# EAGLE schematic MaTouch ESP32-P4 TFT with 4G LTE  Touch 10.1“ MIPI V1.1 (EAGLE 6.1)
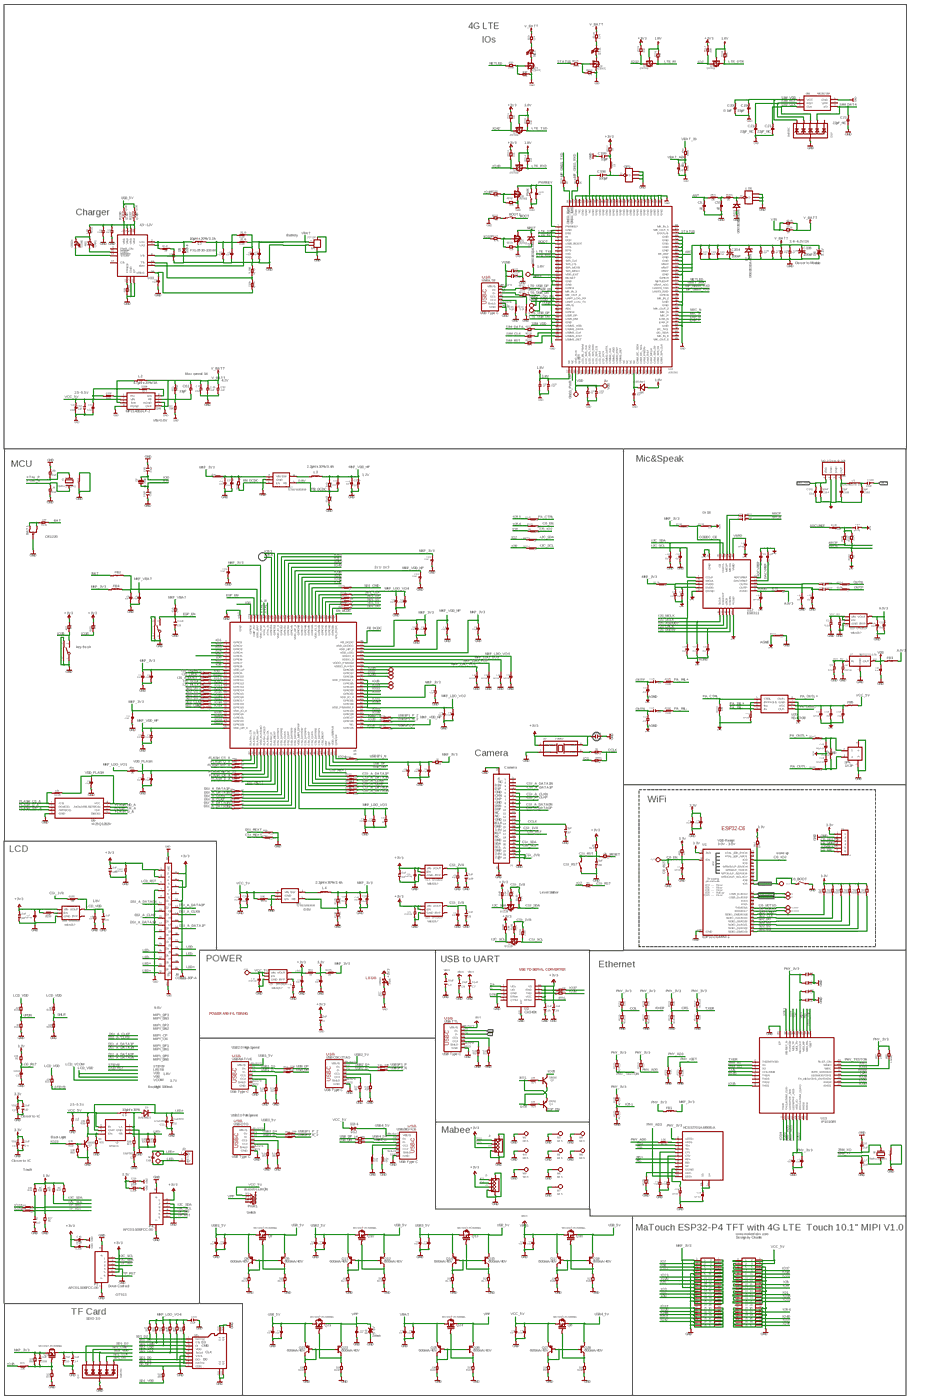
[diagram p0: schematic, sheet 1, overview]
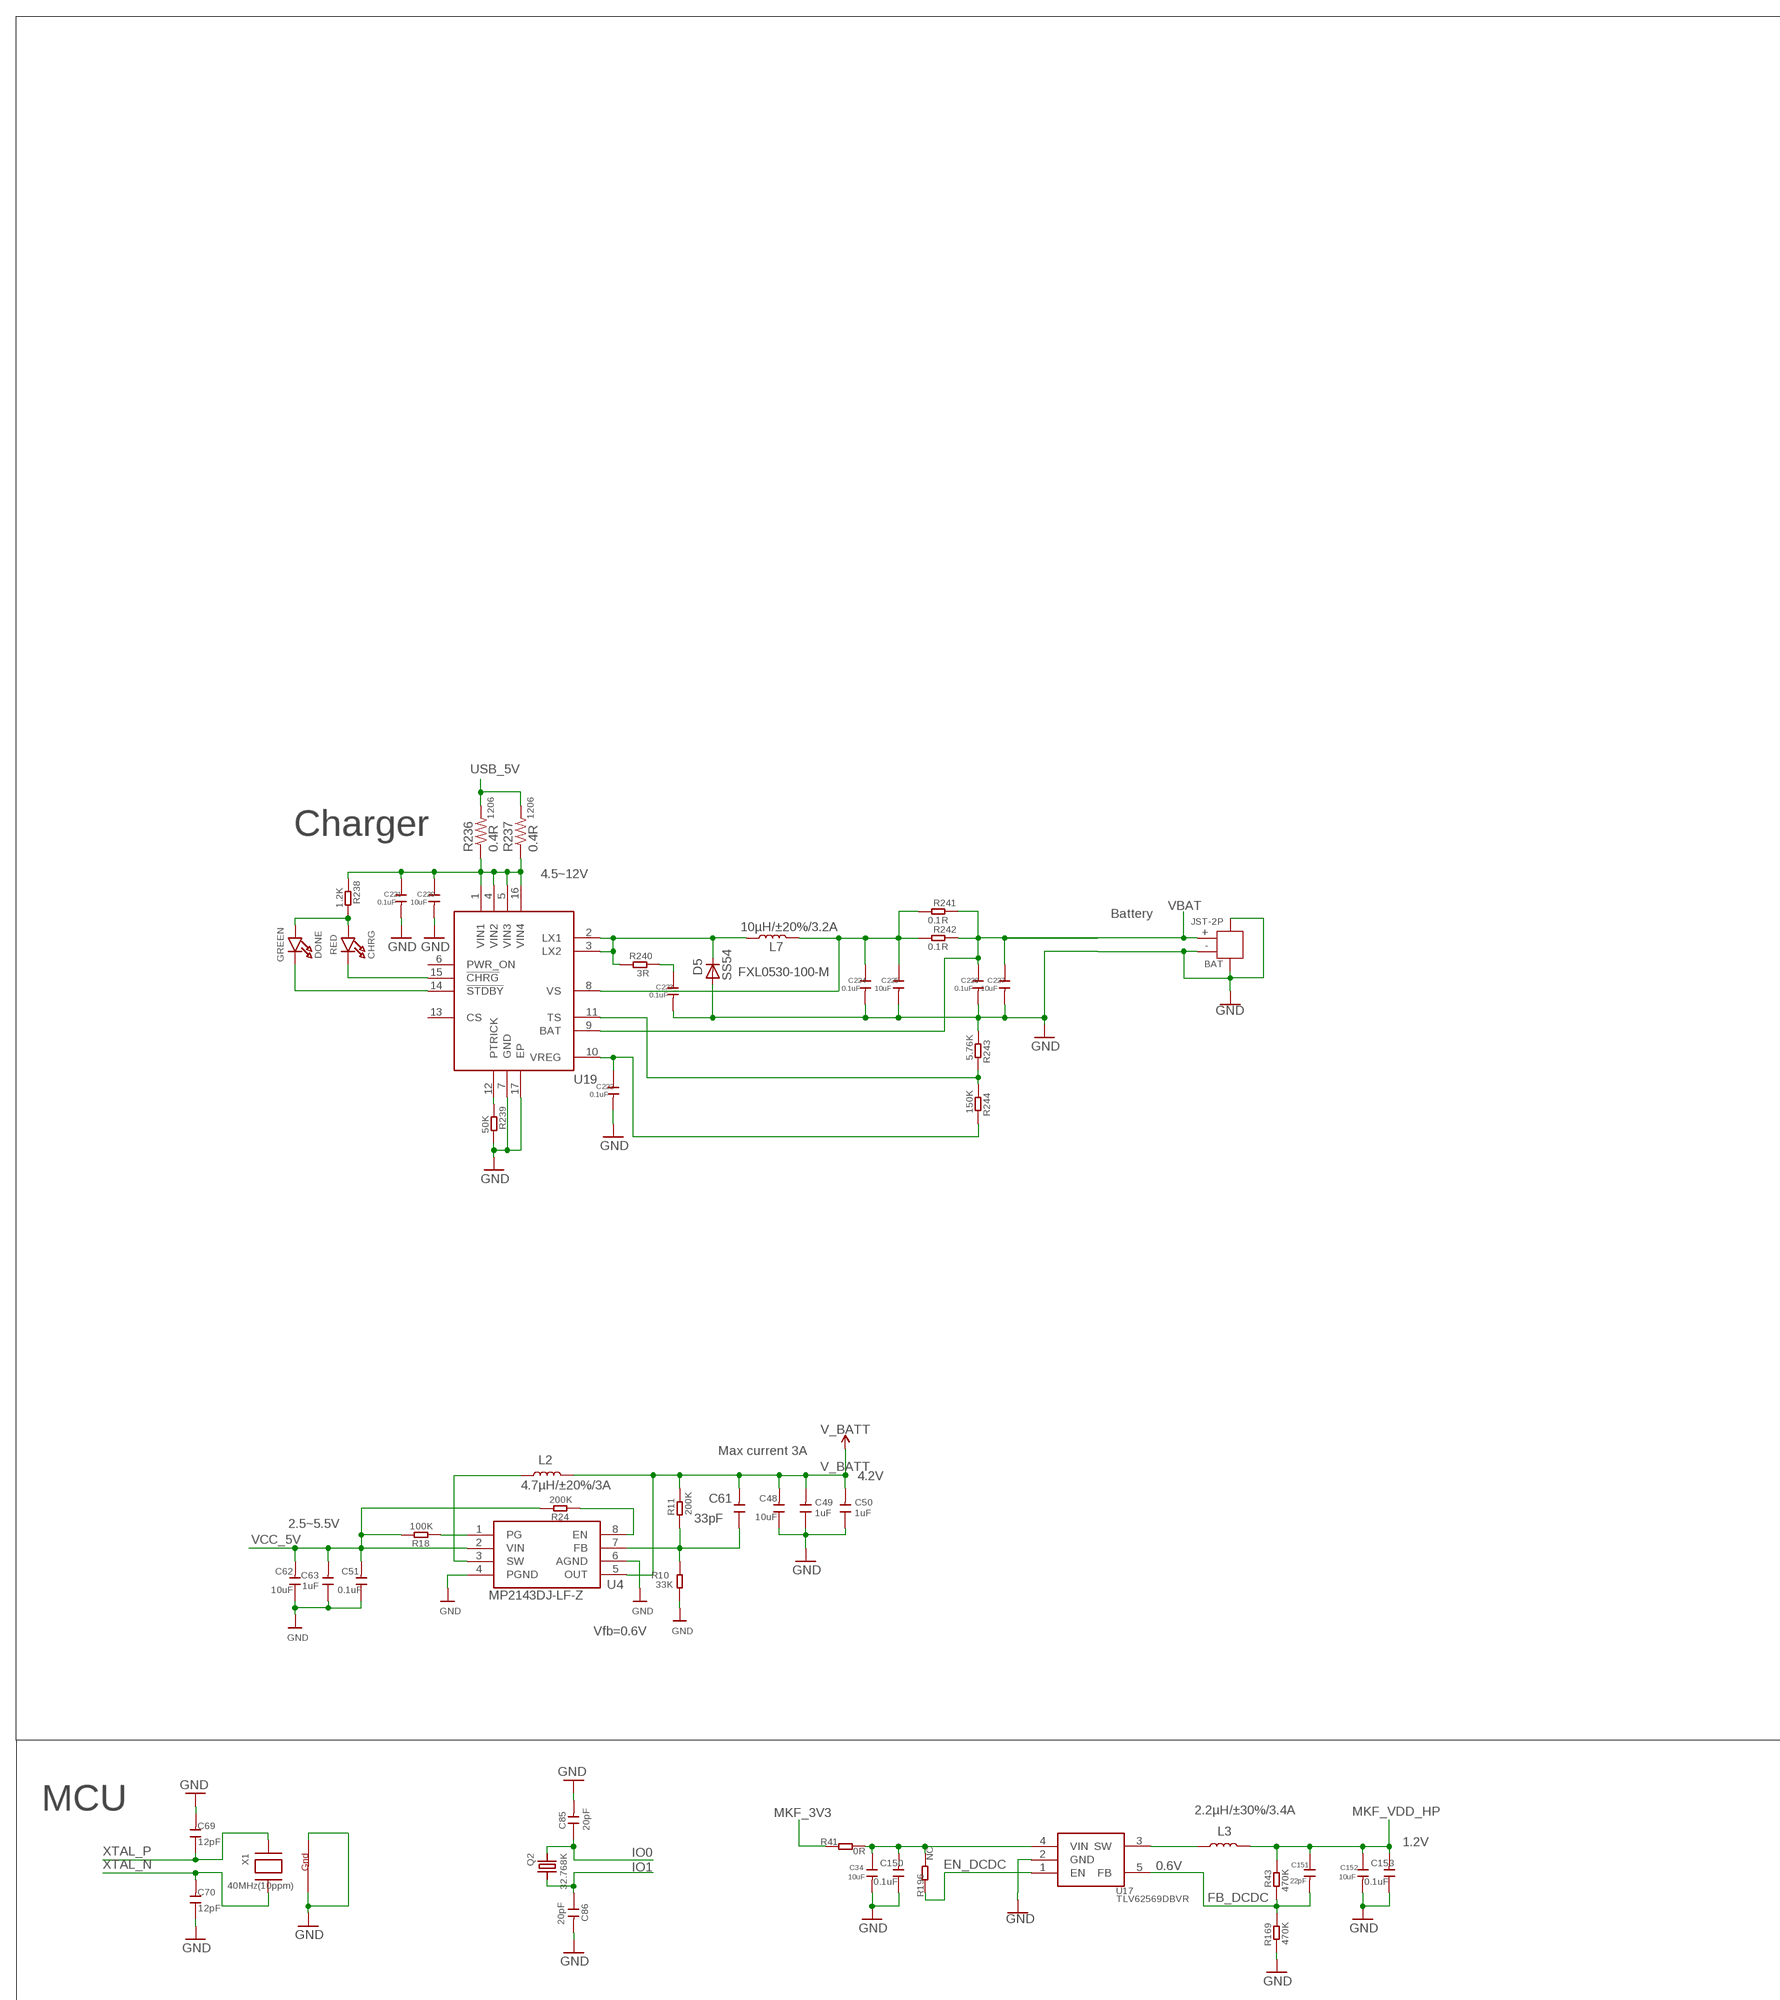
[diagram p1: schematic, sheet 1, part 1 of 6]
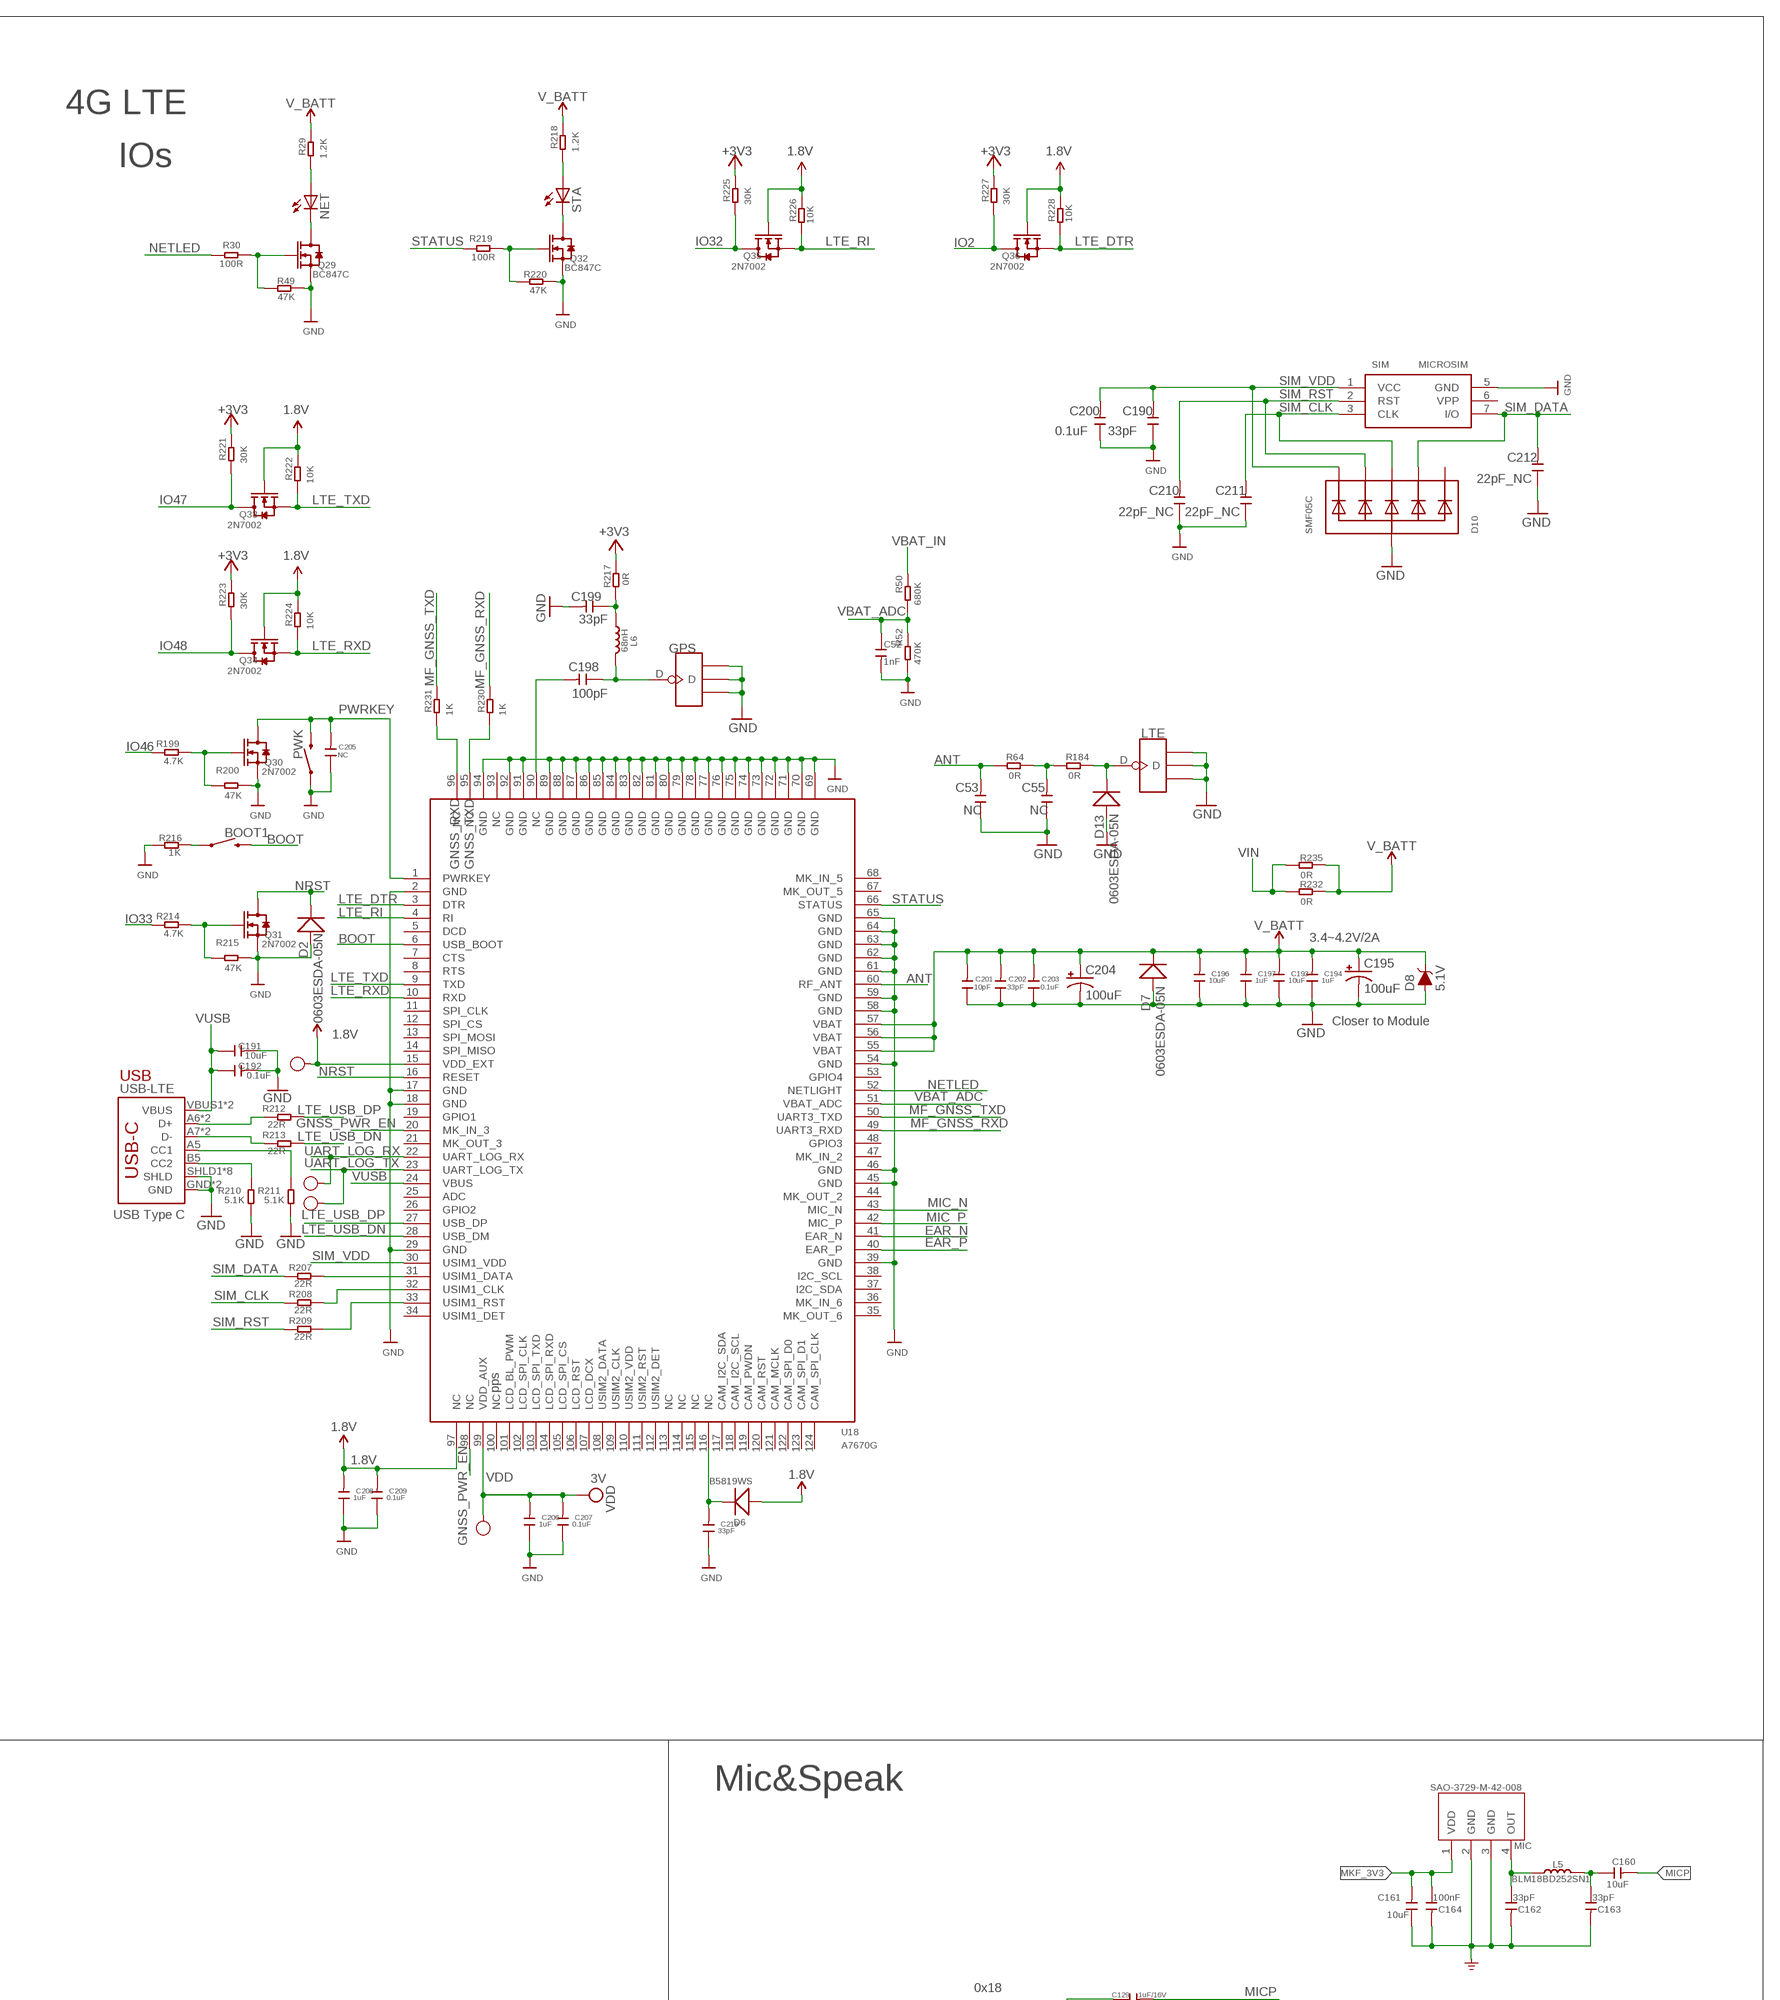
[diagram p2: schematic, sheet 1, part 2 of 6]
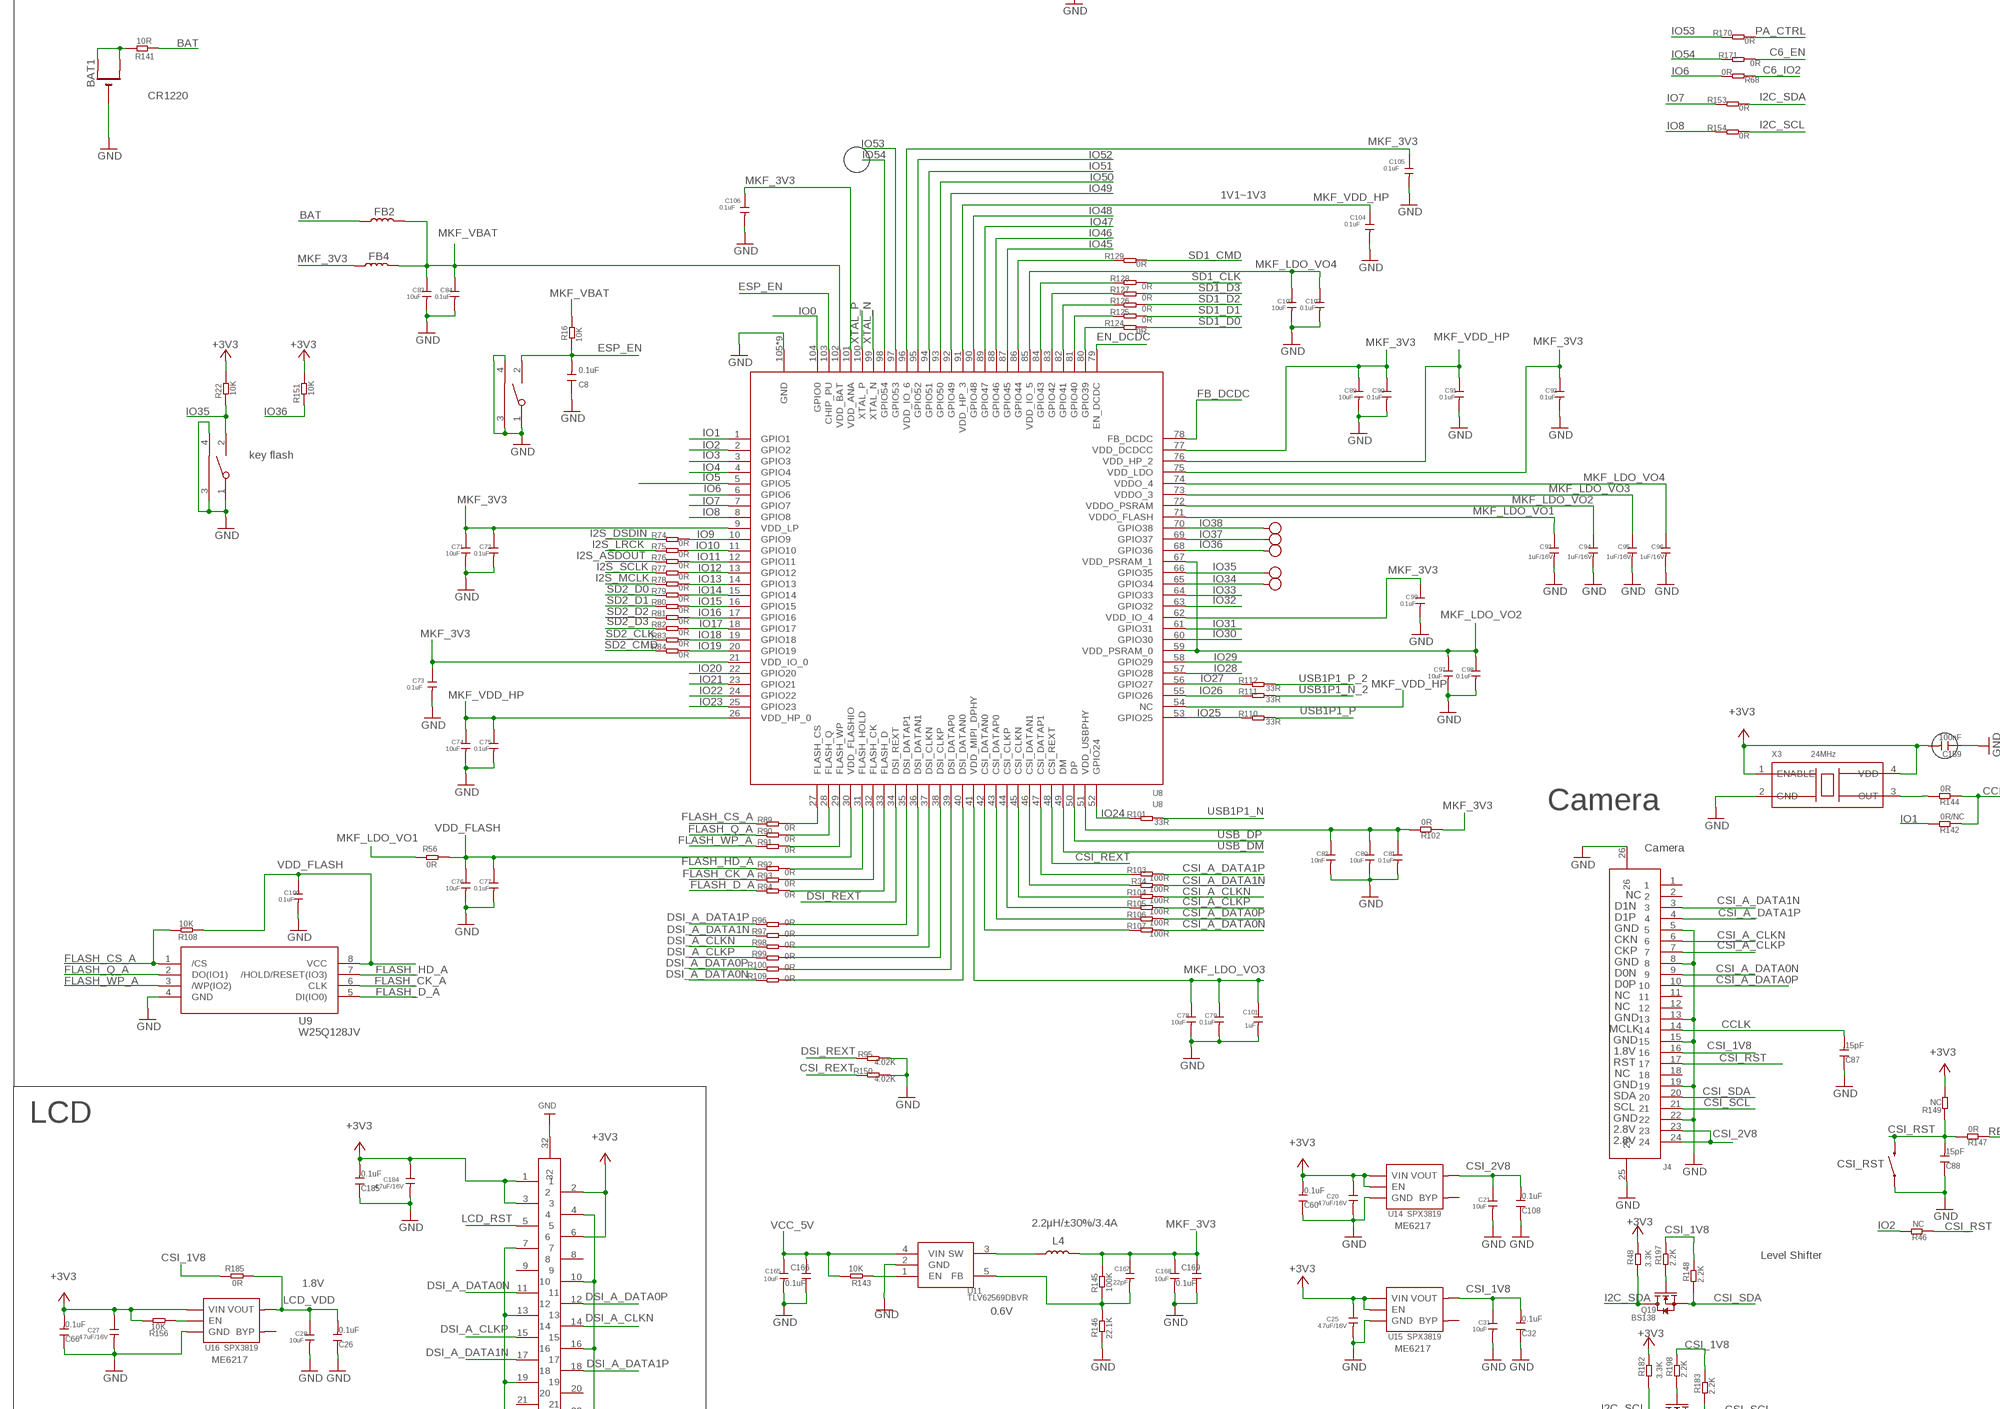
[diagram p3: schematic, sheet 1, part 3 of 6]
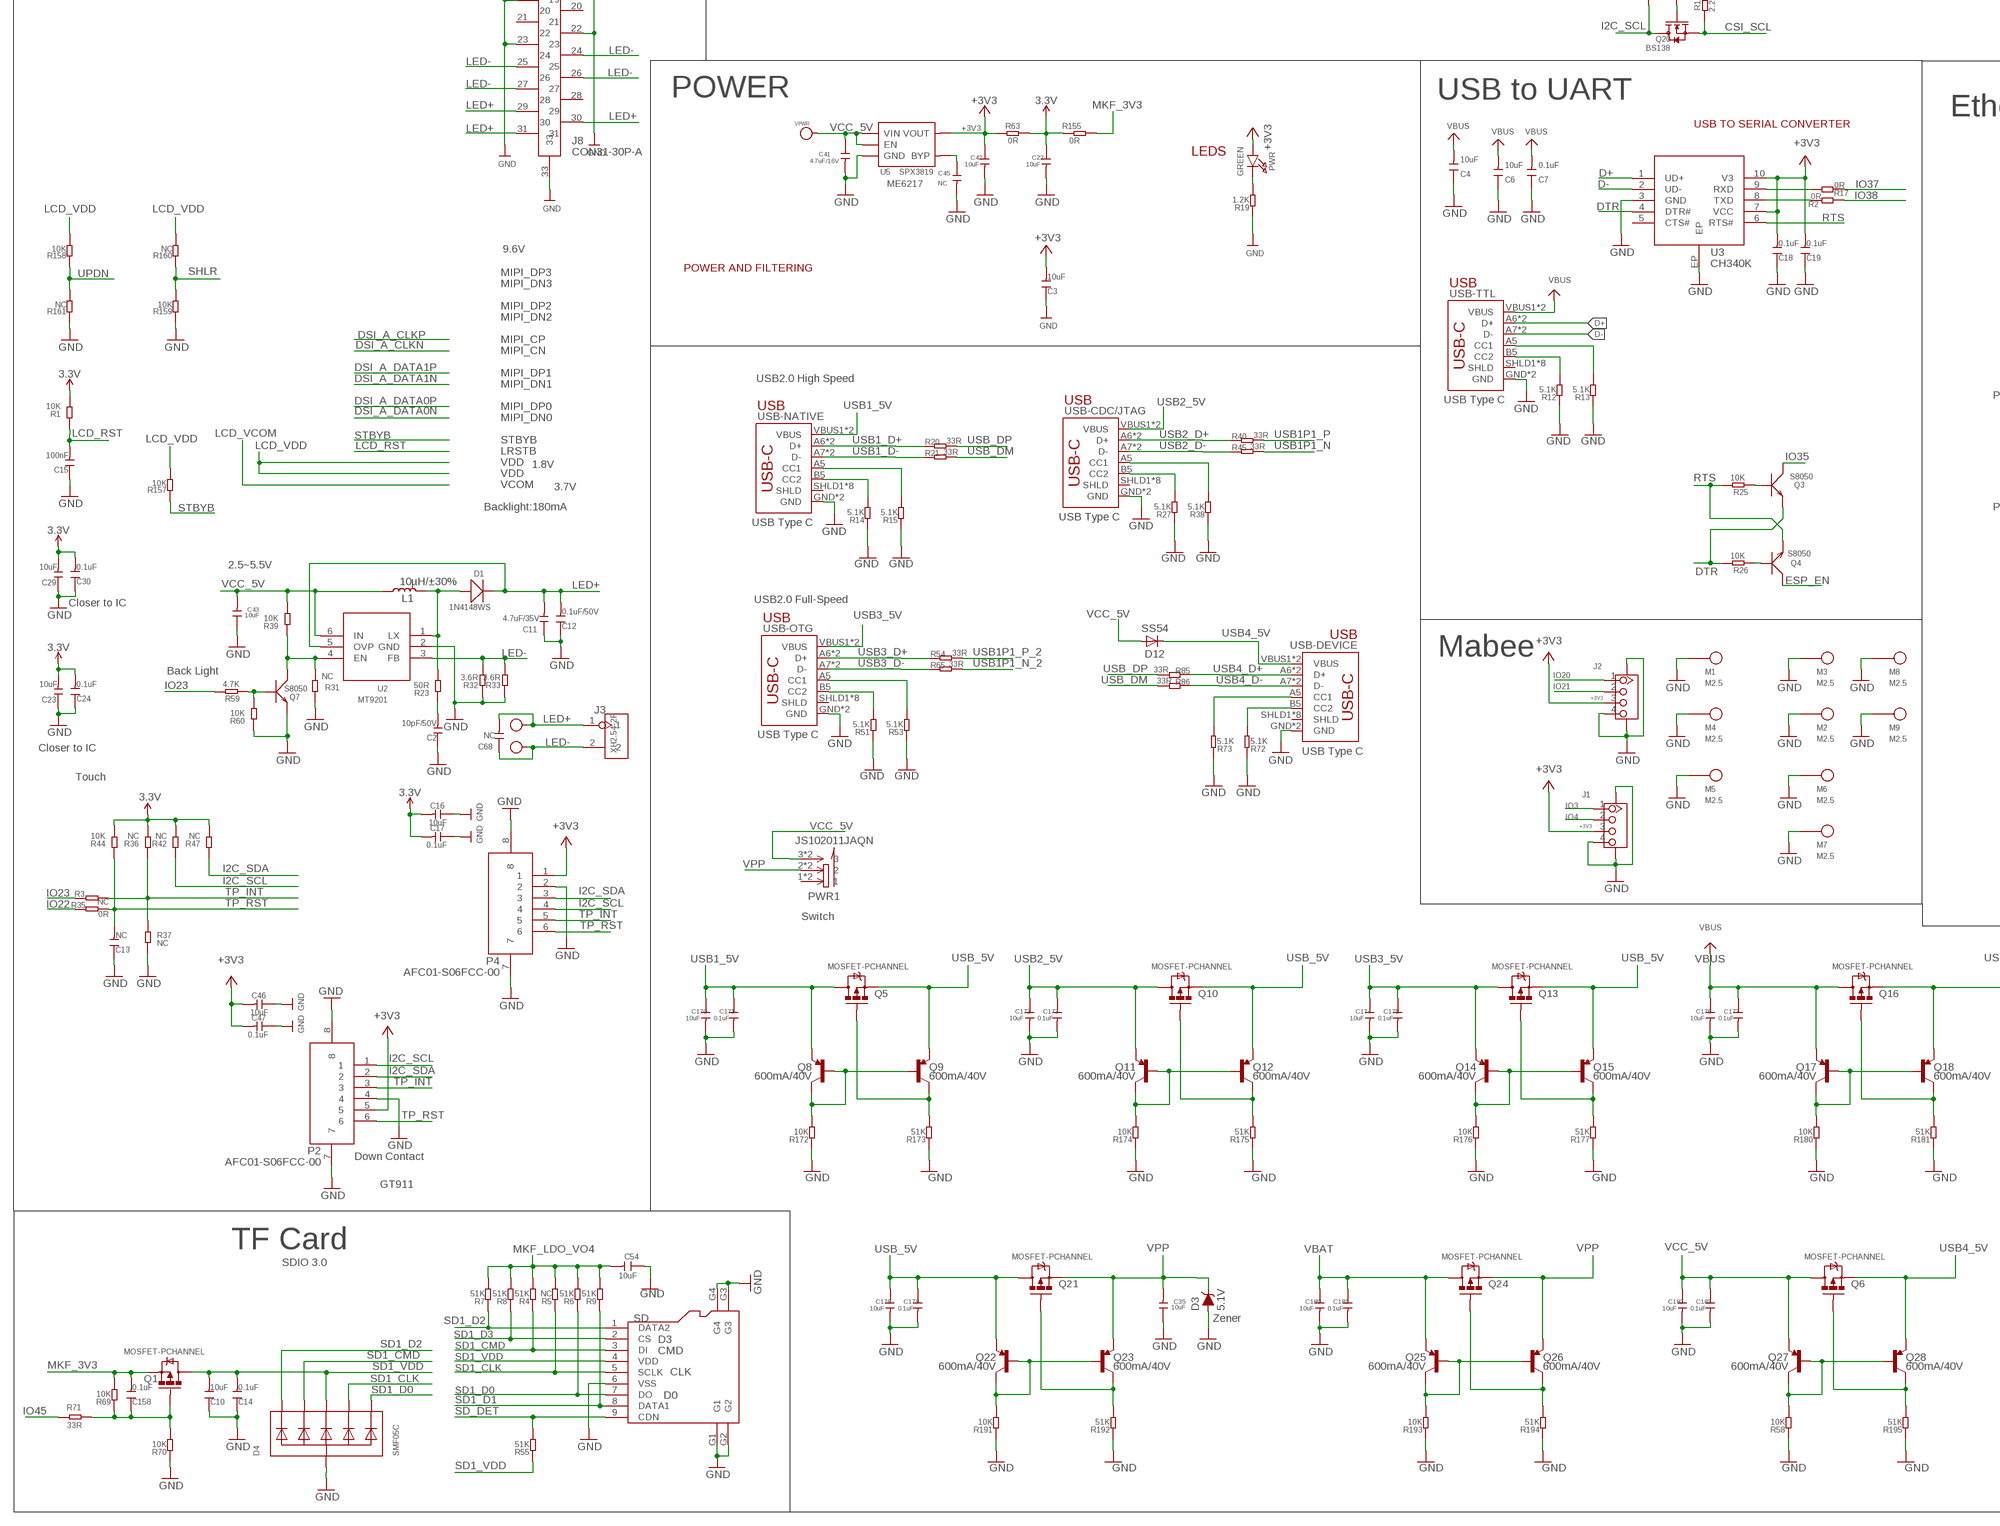
[diagram p4: schematic, sheet 1, part 4 of 6]
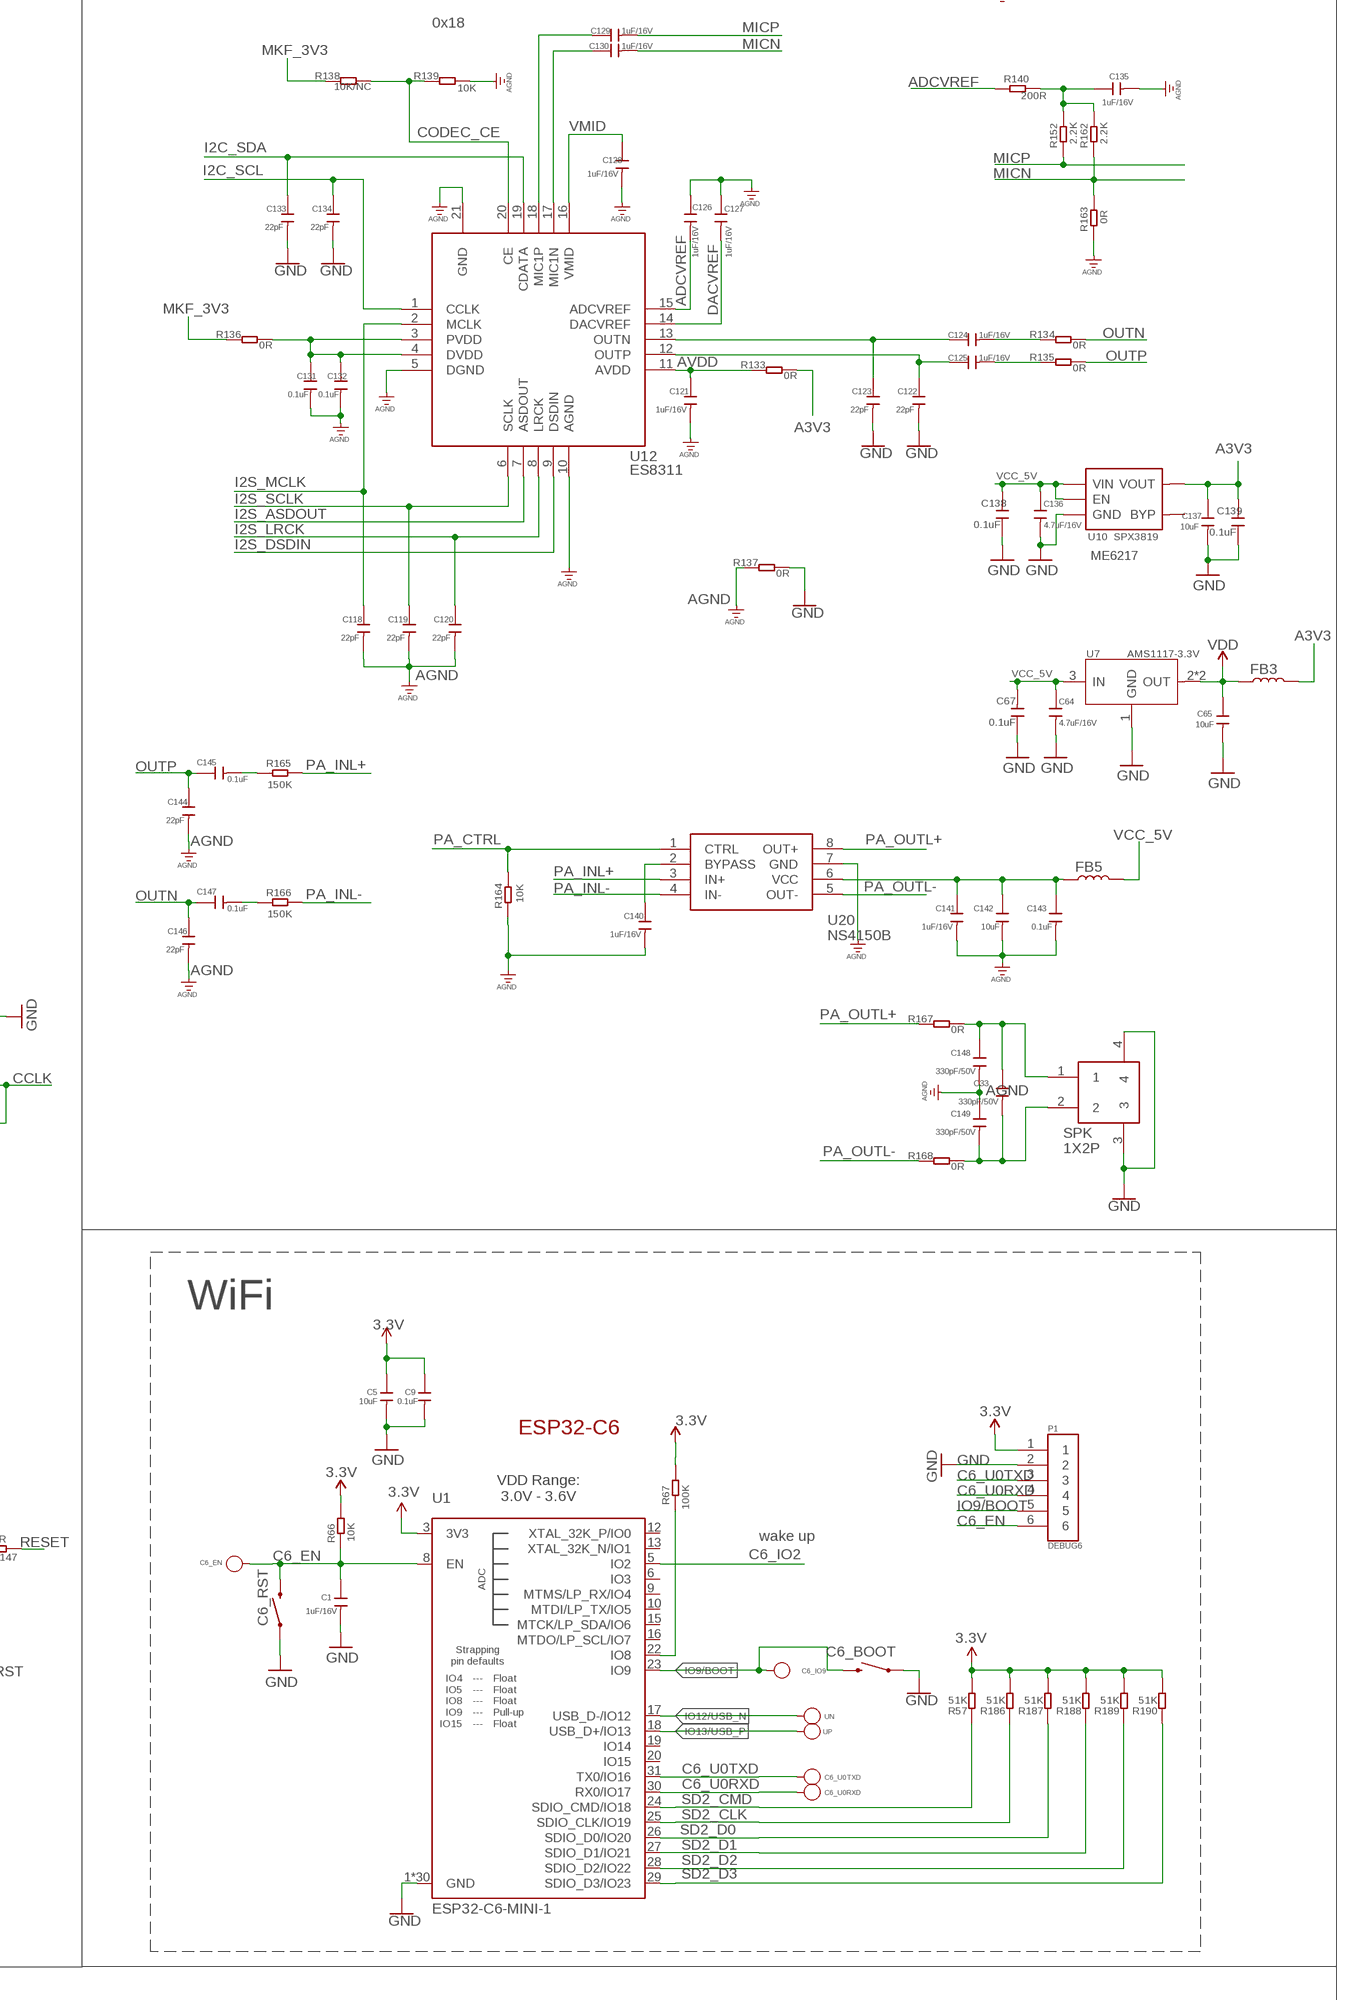
[diagram p5: schematic, sheet 1, part 5 of 6]
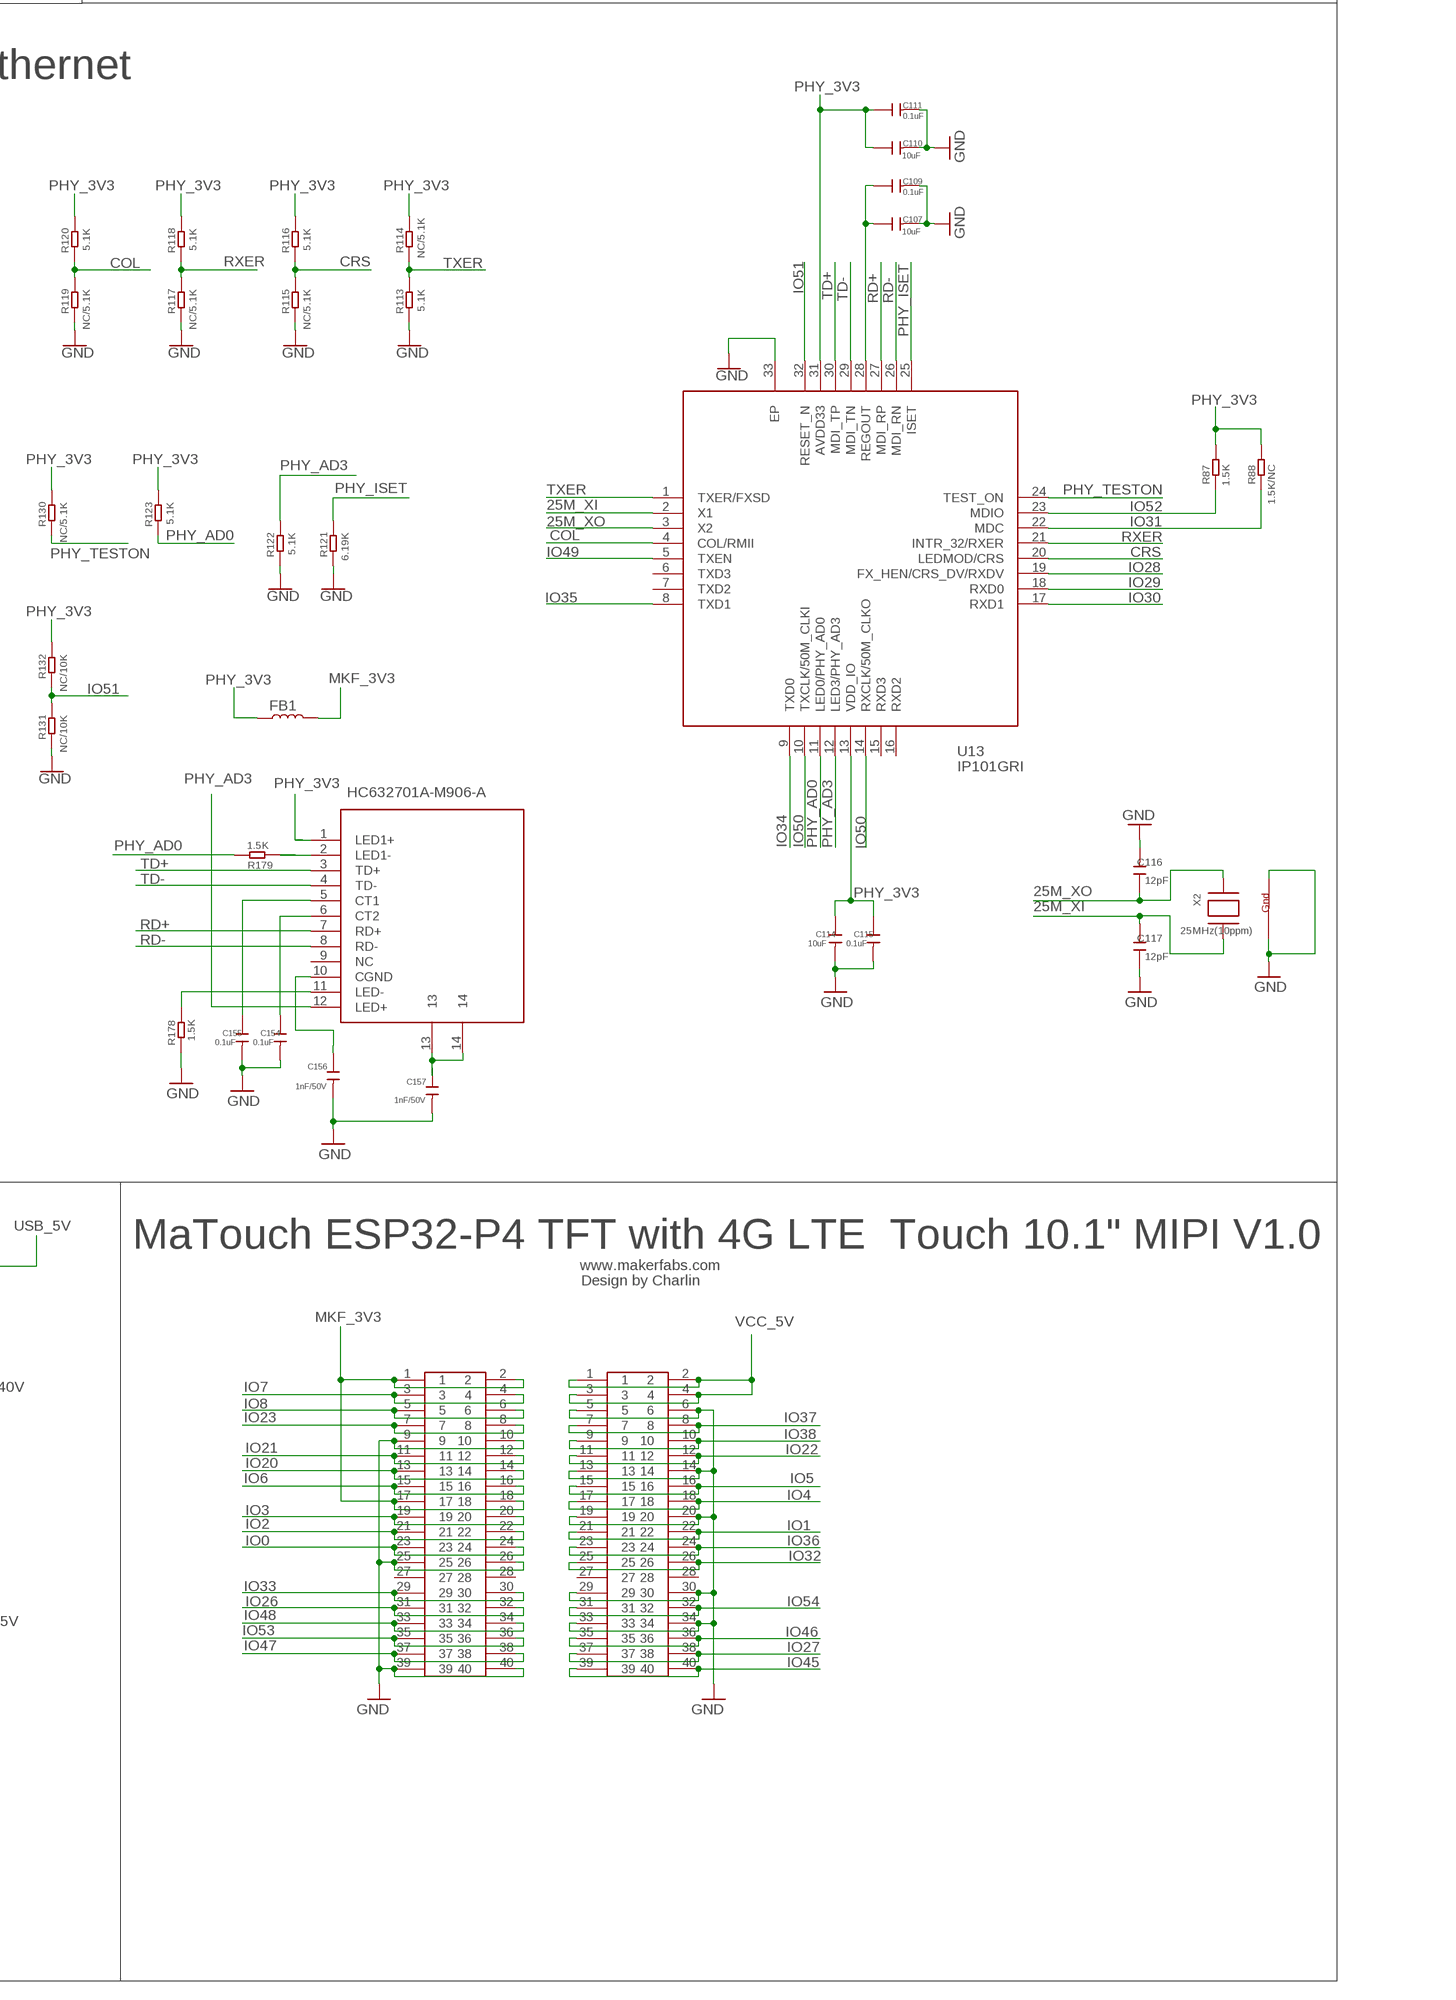
[diagram p6: schematic, sheet 1, part 6 of 6]

## Parts
1V8  TEST-POINT'4545'  [TP-D45MIL]
3V  TEST-POINT'4545'  [TP-D45MIL]
BAT  JST-2P  JST-2P-SMD'2.0'  [HW2-SMD-2.0-90D]
BAT1  CR1220SMT  [CR1220-SMD]
BOOT  TS24CA  [2*4*3.5MM]
BOOT1  MOMENTARY-SWITCH-SPST-SMD-6.0X3.5MM  [TACTILE_SWITCH_SMD_6.0X3.5MM]
C1  1uF/16V  C-0603  [0603]
C2  10pF/50V  DISCRETE_C-0603  [DISCRETE_C0603]
C3  10uF  DISCRETE_C-0603  [DISCRETE_C0603]
C4  10uF  DISCRETE_C-0603  [DISCRETE_C0603]
C5  10uF  C-0603  [0603]
C6  10uF  DISCRETE_C-0603  [DISCRETE_C0603]
C6_BOOT  MOMENTARY-SWITCH-SPST-SMD-4.6X2.8MM  [TACTILE_SWITCH_SMD_4.6X2.8MM]
C6_EN  PAD-TEST-POINT-CIRCLE'4545'  [TP_4545]
C6_IO9  PAD-TEST-POINT-CIRCLE'4545'  [TP_4545]
C6_RST  MOMENTARY-SWITCH-SPST-SMD-4.6X2.8MM  [TACTILE_SWITCH_SMD_4.6X2.8MM]
C6_U0RXD  PAD-TEST-POINT-CIRCLE'4545'  [TP_4545]
C6_U0TXD  PAD-TEST-POINT-CIRCLE'4545'  [TP_4545]
C7  0.1uF  DISCRETE_C-0603  [DISCRETE_C0603]
C8  0.1uF  DISCRETE_C-0603  [DISCRETE_C0603]
C9  0.1uF  C-0603  [0603]
C10  10uF  DISCRETE_C-0603  [DISCRETE_C0603]
C11  4.7uF/35V  DISCRETE_C-1206  [DISCRETE_C1206]
C12  0.1uF/50V  DISCRETE_C-0603  [DISCRETE_C0603]
C13  NC  DISCRETE_C-0603  [DISCRETE_C0603]
C14  0.1uF  DISCRETE_C-0603  [DISCRETE_C0603]
C15  100nF  DISCRETE_C-0603  [DISCRETE_C0603]
C16  10uF  DISCRETE_C-0603  [DISCRETE_C0603]
C17  0.1uF  DISCRETE_C-0603  [DISCRETE_C0603]
C18  0.1uF  DISCRETE_C-0603  [DISCRETE_C0603]
C19  0.1uF  DISCRETE_C-0603  [DISCRETE_C0603]
C20  4.7uF/16V  C-0603  [0603]
C21  10uF  C-0603  [0603]
C22  10uF  C-0603  [0603]
C23  10uF  DISCRETE_C-0603  [DISCRETE_C0603]
C24  0.1uF  DISCRETE_C-0603  [DISCRETE_C0603]
C25  4.7uF/16V  C-0603  [0603]
C26  0.1uF  DISCRETE_C-0603  [DISCRETE_C0603]
C27  4.7uF/16V  C-0603  [0603]
C28  10uF  C-0603  [0603]
C29  10uF  DISCRETE_C-0603  [DISCRETE_C0603]
C30  0.1uF  DISCRETE_C-0603  [DISCRETE_C0603]
C31  10uF  C-0603  [0603]
C32  0.1uF  DISCRETE_C-0603  [DISCRETE_C0603]
C33  330pF/50V  C-0603  [0603]
C34  10uF  C-0603  [0603]
C35  10uF  C-0603  [0603]
C41  4.7uF/16V  C-0603  [0603]
C42  10uF  C-0603  [0603]
C43  10uF  C-0603  [0603]
C45  NC  C-0603  [0603]
C46  10uF  DISCRETE_C-0603  [DISCRETE_C0603]
C47  0.1uF  DISCRETE_C-0603  [DISCRETE_C0603]
C48  10uF  C-0603  [0603]
C49  1uF  C-0603  [0603]
C50  1uF  C-0603  [0603]
C51  0.1uF  C-0603  [0603]
C52  1nF  C-0603  [0603]
C53  NC  C-0603  [0603]
C54  10uF  DISCRETE_C-0603  [DISCRETE_C0603]
C55  NC  C-0603  [0603]
C60  0.1uF  DISCRETE_C-0603  [DISCRETE_C0603]
C61  33pF  C-0603  [0603]
C62  10uF  C-0603  [0603]
C63  1uF  C-0603  [0603]
C64  4.7uF/16V  C-0603  [0603]
C65  10uF  C-0603  [0603]
C66  0.1uF  DISCRETE_C-0603  [DISCRETE_C0603]
C67  0.1uF  C-0603  [0603]
C68  NC  DISCRETE_C-1206  [DISCRETE_C1206]
C69  12pF  DISCRETE_C-0402  [DISCRETE_C0402]
C70  12pF  DISCRETE_C-0402  [DISCRETE_C0402]
C71  10uF  C-0603  [0603]
C72  0.1uF  C-0603  [0603]
C73  0.1uF  C-0603  [0603]
C74  10uF  C-0603  [0603]
C75  0.1uF  C-0603  [0603]
C76  10uF  C-0603  [0603]
C77  0.1uF  C-0603  [0603]
C78  10uF  C-0603  [0603]
C79  0.1uF  C-0603  [0603]
C80  10uF  C-0603  [0603]
C81  0.1uF  C-0603  [0603]
C82  10nF  C-0603  [0603]
C83  10uF  C-0603  [0603]
C84  0.1uF  C-0603  [0603]
C85  20pF  DISCRETE_C-0603  [DISCRETE_C0603]
C86  20pF  DISCRETE_C-0603  [DISCRETE_C0603]
C87  15pF  DISCRETE_C-0603  [DISCRETE_C0603]
C88  15pF  DISCRETE_C-0603  [DISCRETE_C0603]
C89  10uF  C-0603  [0603]
C90  0.1uF  C-0603  [0603]
C91  0.1uF  C-0603  [0603]
C92  0.1uF  C-0603  [0603]
C93  1uF/16V  C-0603  [0603]
C94  1uF/16V  C-0603  [0603]
C95  1uF/16V  C-0603  [0603]
C96  1uF/16V  C-0603  [0603]
C97  10uF  C-0603  [0603]
C98  0.1uF  C-0603  [0603]
C99  0.1uF  C-0603  [0603]
C100  0.1uF  C-0603  [0603]
C101  1uF  C-0603  [0603]
C102  10uF  C-0603  [0603]
C103  0.1uF  C-0603  [0603]
C104  0.1uF  C-0603  [0603]
C105  0.1uF  C-0603  [0603]
C106  0.1uF  C-0603  [0603]
C107  10uF  C-0603  [0603]
C108  0.1uF  DISCRETE_C-0603  [DISCRETE_C0603]
C109  0.1uF  C-0603  [0603]
C110  10uF  C-0603  [0603]
C111  0.1uF  C-0603  [0603]
C114  10uF  C-0603  [0603]
C115  0.1uF  C-0603  [0603]
C116  12pF  DISCRETE_C-0402  [DISCRETE_C0402]
C117  12pF  DISCRETE_C-0402  [DISCRETE_C0402]
C118  22pF  C-0603  [0603]
C119  22pF  C-0603  [0603]
C120  22pF  C-0603  [0603]
C121  1uF/16V  C-0603  [0603]
C122  22pF  C-0603  [0603]
C123  22pF  C-0603  [0603]
C124  1uF/16V  C-0603  [0603]
C125  1uF/16V  C-0603  [0603]
C126  1uF/16V  C-0603  [0603]
C127  1uF/16V  C-0603  [0603]
C128  1uF/16V  C-0603  [0603]
C129  1uF/16V  C-0603  [0603]
C130  1uF/16V  C-0603  [0603]
C131  0.1uF  C-0603  [0603]
C132  0.1uF  C-0603  [0603]
C133  22pF  C-0603  [0603]
C134  22pF  C-0603  [0603]
C135  1uF/16V  C-0603  [0603]
C136  4.7uF/16V  C-0603  [0603]
C137  10uF  C-0603  [0603]
C138  0.1uF  C-0603  [0603]
C139  0.1uF  C-0603  [0603]
C140  1uF/16V  C-0603  [0603]
C141  1uF/16V  C-0603  [0603]
C142  10uF  C-0603  [0603]
C143  0.1uF  C-0603  [0603]
C144  22pF  C-0603  [0603]
C145  0.1uF  C-0603  [0603]
C146  22pF  C-0603  [0603]
C147  0.1uF  C-0603  [0603]
C148  330pF/50V  C-0603  [0603]
C149  330pF/50V  C-0603  [0603]
C150  0.1uF  C-0603  [0603]
C151  22pF  C-0603  [0603]
C152  10uF  C-0603  [0603]
C153  0.1uF  C-0603  [0603]
C154  0.1uF  C-0603  [0603]
C155  0.1uF  C-0603  [0603]
C156  1nF/50V  C-0603  [0603]
C157  1nF/50V  C-0603  [0603]
C158  0.1uF  DISCRETE_C-0603  [DISCRETE_C0603]
C159  100nF  CAP-0402  [C0402]
C160  10uF  CAP-0603  [C0603]
C161  10uF  CAP-0603  [C0603]
C162  33pF  CAP-0603  [C0603]
C163  33pF  CAP-0603  [C0603]
C164  100nF  CAP-0603  [C0603]
C165  10uF  C-0603  [0603]
C166  0.1uF  C-0603  [0603]
C167  22pF  C-0603  [0603]
C168  10uF  C-0603  [0603]
C169  0.1uF  C-0603  [0603]
C170  10uF  C-0603  [0603]
C171  0.1uF  C-0603  [0603]
C172  10uF  C-0603  [0603]
C173  0.1uF  C-0603  [0603]
C174  10uF  C-0603  [0603]
C175  0.1uF  C-0603  [0603]
C176  10uF  C-0603  [0603]
C177  0.1uF  C-0603  [0603]
C178  10uF  C-0603  [0603]
C179  0.1uF  C-0603  [0603]
C180  10uF  C-0603  [0603]
C181  0.1uF  C-0603  [0603]
C182  10uF  C-0603  [0603]
C183  0.1uF  C-0603  [0603]
C184  4.7uF/16V  C-0603  [0603]
C185  0.1uF  DISCRETE_C-0603  [DISCRETE_C0603]
C190  33pF  C-0603  [0603]
C191  10uF  C-0603  [0603]
C192  0.1uF  C-0603  [0603]
C193  10uF  C-0603  [0603]
C194  1uF  C-0603  [0603]
C195  100uF  68UF-POLAR-EIA3528-10V-10%(TANT)  [EIA3528]
C196  10uF  C-0603  [0603]
C197  1uF  C-0603  [0603]
C198  100pF  C-0603  [0603]
C199  33pF  C-0603  [0603]
C200  0.1uF  C-0603  [0603]
C201  10pF  C-0603  [0603]
C202  33pF  C-0603  [0603]
C203  0.1uF  C-0603  [0603]
C204  100uF  68UF-POLAR-EIA3528-10V-10%(TANT)  [EIA3528]
C205  NC  C-0603  [0603]
C206  1uF  C-0603  [0603]
C207  0.1uF  C-0603  [0603]
C208  1uF  C-0603  [0603]
C209  0.1uF  C-0603  [0603]
C210  22pF_NC  C-0603  [0603]
C211  22pF_NC  C-0603  [0603]
C212  22pF_NC  C-0603  [0603]
C219  33pF  C-0603  [0603]
C220  10uF  C-0603  [0603]
C221  0.1uF  C-0603  [0603]
C222  0.1uF  C-0603  [0603]
C223  0.1uF  C-0603  [0603]
C224  0.1uF  C-0603  [0603]
C225  10uF  C-0603  [0603]
C226  0.1uF  C-0603  [0603]
C227  10uF  C-0603  [0603]
CHRG  RED  LED0805_NOOUTLINE  [CHIPLED_0805_NOOUTLINE]
CSI_RST  MOMENTARY-SWITCH-SPST-SMD-4.6X2.8MM  [TACTILE_SWITCH_SMD_4.6X2.8MM]
D1  1N4148WS  D'0805'  [SOD323]
D2  0603ESDA-05N  DISCRETE_D0603  [DISCRETE_SOD523]
D3  5.1V  DIODE-ZENER-MMSZ5232BS  [SOD-323]
D4  SMF05C  TVSARRAY_5LANE  [SOT363]
D5  SS54  DIODE-DO-214AC  [DO-214AC]
D6  B5819WS  D'0805'  [SOD323]
D7  0603ESDA-05N  DISCRETE_D0603  [DISCRETE_SOD523]
D8  5.1V  DIODE-ZENER-MMSZ5232BS  [SOD-323]
D10  SMF05C  TVSARRAY_5LANE  [SOT363]
D12  SS54  DIODE-DO-214AC  [DO-214AC]
D13  0603ESDA-05N  DISCRETE_D0603  [DISCRETE_SOD523]
D+  TEST-POINT'4545'  [TP-D45MIL]
D-  TEST-POINT'4545'  [TP-D45MIL]
DONE  GREEN  LED0805_NOOUTLINE  [CHIPLED_0805_NOOUTLINE]
FB1  INDUCTORFB-30OHM  [0603]
FB2  INDUCTORFB-30OHM  [0603]
FB3  INDUCTORFB-30OHM  [0603]
FB4  INDUCTORFB-30OHM  [0603]
FB5  INDUCTORFB-30OHM  [0603]
GPS  ANTENNA-U-FL  [4P-U-FL]
IO34  TEST-POINT'4545'  [TP-D45MIL]
IO35  TEST-POINT'4545'  [TP-D45MIL]
IO36  TEST-POINT'4545'  [TP-D45MIL]
IO37  TEST-POINT'4545'  [TP-D45MIL]
IO38  TEST-POINT'4545'  [TP-D45MIL]
J1  GROVE-CONNECTOR-SMD'90D'  [HW4-SMD-2.0-90D]
J2  GROVE-CONNECTOR-SMD'90D'  [HW4-SMD-2.0-90D]
J3  XH2.54-2P  [XH2.54-2P]
J4  FPC-24P  [SMD26-50P-1760L450W]
J6  CON2X20-254P-A  [SMD2X20-254P-5080L750W920H]
J7  HR961160C  [HR961160C]
J8  CON31-30P-A  [SMD31-30P-1090L320W100H]
J10  CON2X20-254P-A  [SMD2X20-254P-5080L750W920H]
L1  10µH/±30%  INDUCTOR-CR54-3.3UH  [CR54]
L2  4.7µH/±20%/3A  INDUCTOR-SRN6045-33UH  [SRN6045]
L3  2.2µH/±30%/3.4A  INDUCTOR-CR54-3.3UH  [CR54]
L4  2.2µH/±30%/3.4A  INDUCTOR-CR54-3.3UH  [CR54]
L5  BLM18BD252SN1  INDUCTOR/FERRITE-BEAD'0603'  [L0603]
L6  68nH  L'0603'  [L0603]
L7  10µH/±20%/3.2A  INDUCTOR-CR54-47UH  [CR54]
LTE  ANTENNA-U-FL  [4P-U-FL]
M1  M2.5  [M2.5]
M2  M2.5  [M2.5]
M3  M2.5  [M2.5]
M4  M2.5  [M2.5]
M5  M2.5  [M2.5]
M6  M2.5  [M2.5]
M7  M2.5  [M2.5]
M8  M2.5  [M2.5]
M9  M2.5  [M2.5]
MIC  SAO-3729-M-42-008  MIC-MSM421A3729H8-C  [MIC4-SMD-3.76X2.95MM]
NET  NET  LEDCHIP-LED0805  [CHIP-LED0805]
P1  DEBUG6  [DEBUG*6]
P2  AFC01-S06FCC-00  [SMD8-50P-740L535W]
P4  AFC01-S06FCC-00  [SMD8-50P-740L535W]
PWK  MOMENTARY-SWITCH-SPST-SMD-6.0X3.5MM  [TACTILE_SWITCH_SMD_6.0X3.5MM]
PWR  GREEN  LED0805_NOOUTLINE  [CHIPLED_0805_NOOUTLINE]
PWR1  JS102011JAQN  [SMD-6-2.5MM]
Q1  MOSFET-PCHANNEL  [SOT23-3]
Q2  32.768K  CRYSTAL_3215  [XTAL3215]
Q3  S8050  TRANSISTOR-NPN-SOT23  [SOT23]
Q4  S8050  TRANSISTOR-NPN-SOT23  [SOT23]
Q5  MOSFET-PCHANNEL  [SOT23-3]
Q6  MOSFET-PCHANNEL  [SOT23-3]
Q7  S8050  TRANSISTOR-NPN-SOT23  [SOT23]
Q8  600mA/40V  TRANS_PNP-MMBT4403  [SOT23-3]
Q9  600mA/40V  TRANS_PNP-MMBT4403  [SOT23-3]
Q10  MOSFET-PCHANNEL  [SOT23-3]
Q11  600mA/40V  TRANS_PNP-MMBT4403  [SOT23-3]
Q12  600mA/40V  TRANS_PNP-MMBT4403  [SOT23-3]
Q13  MOSFET-PCHANNEL  [SOT23-3]
Q14  600mA/40V  TRANS_PNP-MMBT4403  [SOT23-3]
Q15  600mA/40V  TRANS_PNP-MMBT4403  [SOT23-3]
Q16  MOSFET-PCHANNEL  [SOT23-3]
Q17  600mA/40V  TRANS_PNP-MMBT4403  [SOT23-3]
Q18  600mA/40V  TRANS_PNP-MMBT4403  [SOT23-3]
Q19  BS138  MOSFET-N'SOT23'  [SOT23]
Q20  BS138  MOSFET-N'SOT23'  [SOT23]
Q21  MOSFET-PCHANNEL  [SOT23-3]
Q22  600mA/40V  TRANS_PNP-MMBT4403  [SOT23-3]
Q23  600mA/40V  TRANS_PNP-MMBT4403  [SOT23-3]
Q24  MOSFET-PCHANNEL  [SOT23-3]
Q25  600mA/40V  TRANS_PNP-MMBT4403  [SOT23-3]
Q26  600mA/40V  TRANS_PNP-MMBT4403  [SOT23-3]
Q27  600mA/40V  TRANS_PNP-MMBT4403  [SOT23-3]
Q28  600mA/40V  TRANS_PNP-MMBT4403  [SOT23-3]
Q29  BC847C  MOSFET-N'SOT23'  [SOT23]
Q30  2N7002  MOSFET-N'SOT23'  [SOT23]
Q31  2N7002  MOSFET-N'SOT23'  [SOT23]
Q32  BC847C  MOSFET-N'SOT23'  [SOT23]
Q33  2N7002  MOSFET-N'SOT23'  [SOT23]
Q34  2N7002  MOSFET-N'SOT23'  [SOT23]
Q35  2N7002  MOSFET-N'SOT23'  [SOT23]
Q36  2N7002  MOSFET-N'SOT23'  [SOT23]
R1  10K  DISCRETE_R-0603  [DISCRETE_R0603]
R2  0R  R-0603  [R0603]
R3  NC  R-0603  [R0603]
R4  51K  DISCRETE_R-0603  [DISCRETE_R0603]
R5  NC  DISCRETE_R-0603  [DISCRETE_R0603]
R6  51K  DISCRETE_R-0603  [DISCRETE_R0603]
R7  51K  DISCRETE_R-0603  [DISCRETE_R0603]
R8  51K  DISCRETE_R-0603  [DISCRETE_R0603]
R9  51K  DISCRETE_R-0603  [DISCRETE_R0603]
R10  33K  R-0603  [R0603]
R11  200K  R-0603  [R0603]
R12  5.1K  DISCRETE_R-0603  [DISCRETE_R0603]
R13  5.1K  DISCRETE_R-0603  [DISCRETE_R0603]
R14  5.1K  DISCRETE_R-0603  [DISCRETE_R0603]
R15  5.1K  DISCRETE_R-0603  [DISCRETE_R0603]
R16  10K  R-0603  [R0603]
R17  0R  R-0603  [R0603]
R18  100K  R-0603  [R0603]
R19  1.2K  DISCRETE_R-0603  [DISCRETE_R0603]
R20  33R  R-0603  [R0603]
R21  33R  R-0603  [R0603]
R22  10K  R-0603  [R0603]
R23  50R  DISCRETE_R-0603  [DISCRETE_R0603]
R24  200K  R-0603  [R0603]
R25  10K  R-0603  [R0603]
R26  10K  R-0603  [R0603]
R27  5.1K  DISCRETE_R-0603  [DISCRETE_R0603]
R29  1.2K  R-0603  [R0603]
R30  100R  R-0603  [R0603]
R31  NC  DISCRETE_R-0603  [DISCRETE_R0603]
R32  3.6R  DISCRETE_R-0603  [DISCRETE_R0603]
R33  3.6R  DISCRETE_R-0603  [DISCRETE_R0603]
R34  100R  R-0603  [R0603]
R35  0R  R-0603  [R0603]
R36  NC  DISCRETE_R-0603  [DISCRETE_R0603]
R37  NC  DISCRETE_R-0603  [DISCRETE_R0603]
R38  5.1K  DISCRETE_R-0603  [DISCRETE_R0603]
R39  10K  DISCRETE_R-0603  [DISCRETE_R0603]
R40  33R  R-0603  [R0603]
R41  0R  R-0603  [R0603]
R42  NC  DISCRETE_R-0603  [DISCRETE_R0603]
R43  470K  R-0603  [R0603]
R44  10K  DISCRETE_R-0603  [DISCRETE_R0603]
R45  33R  R-0603  [R0603]
R46  NC  R-0603  [R0603]
R47  NC  DISCRETE_R-0603  [DISCRETE_R0603]
R48  3.3K  R-0603  [R0603]
R49  47K  R-0603  [R0603]
R50  680K  R-0603  [R0603]
R51  5.1K  DISCRETE_R-0603  [DISCRETE_R0603]
R52  470K  R-0603  [R0603]
R53  5.1K  DISCRETE_R-0603  [DISCRETE_R0603]
R54  33R  R-0603  [R0603]
R55  51K  DISCRETE_R-0603  [DISCRETE_R0603]
R56  0R  R-0603  [R0603]
R57  51K  DISCRETE_R-0603  [DISCRETE_R0603]
R58  10K  DISCRETE_R-0603  [DISCRETE_R0603]
R59  4.7K  DISCRETE_R-0603  [DISCRETE_R0603]
R60  10K  DISCRETE_R-0603  [DISCRETE_R0603]
R63  0R  R-0603  [R0603]
R64  0R  R-0603  [R0603]
R65  33R  R-0603  [R0603]
R66  10K  R-0603  [R0603]
R67  100K  R-0603  [R0603]
R68  0R  R-0603  [R0603]
R69  10K  DISCRETE_R-0603  [DISCRETE_R0603]
R70  10K  DISCRETE_R-0603  [DISCRETE_R0603]
R71  33R  R-0603  [R0603]
R72  5.1K  DISCRETE_R-0603  [DISCRETE_R0603]
R73  5.1K  DISCRETE_R-0603  [DISCRETE_R0603]
R74  0R  R-0603  [R0603]
R75  0R  R-0603  [R0603]
R76  0R  R-0603  [R0603]
R77  0R  R-0603  [R0603]
R78  0R  R-0603  [R0603]
R79  0R  R-0603  [R0603]
R80  0R  R-0603  [R0603]
R81  0R  R-0603  [R0603]
R82  0R  R-0603  [R0603]
R83  0R  R-0603  [R0603]
R84  0R  R-0603  [R0603]
R85  33R  R-0603  [R0603]
R86  33R  R-0603  [R0603]
R87  1.5K  R-0603  [R0603]
R88  1.5K/NC  R-0603  [R0603]
R89  0R  R-0603  [R0603]
R90  0R  R-0603  [R0603]
R91  0R  R-0603  [R0603]
R92  0R  R-0603  [R0603]
R93  0R  R-0603  [R0603]
R94  0R  R-0603  [R0603]
R95  4.02K  R-0603  [R0603]
R96  0R  R-0603  [R0603]
R97  0R  R-0603  [R0603]
R98  0R  R-0603  [R0603]
R99  0R  R-0603  [R0603]
R100  0R  R-0603  [R0603]
R101  33R  R-0603  [R0603]
R102  0R  R-0603  [R0603]
R103  100R  R-0603  [R0603]
R104  100R  R-0603  [R0603]
R105  100R  R-0603  [R0603]
R106  100R  R-0603  [R0603]
R107  100R  R-0603  [R0603]
R108  10K  DISCRETE_R-0603  [DISCRETE_R0603]
R109  0R  R-0603  [R0603]
R110  33R  R-0603  [R0603]
R111  33R  R-0603  [R0603]
R112  33R  R-0603  [R0603]
R113  5.1K  R-0603  [R0603]
R114  NC/5.1K  R-0603  [R0603]
R115  NC/5.1K  R-0603  [R0603]
R116  5.1K  R-0603  [R0603]
R117  NC/5.1K  R-0603  [R0603]
R118  5.1K  R-0603  [R0603]
R119  NC/5.1K  R-0603  [R0603]
R120  5.1K  R-0603  [R0603]
R121  6.19K  R-0603  [R0603]
R122  5.1K  R-0603  [R0603]
R123  5.1K  R-0603  [R0603]
R124  0R  R-0603  [R0603]
R125  0R  R-0603  [R0603]
R126  0R  R-0603  [R0603]
R127  0R  R-0603  [R0603]
R128  0R  R-0603  [R0603]
R129  0R  R-0603  [R0603]
R130  NC/5.1K  R-0603  [R0603]
R131  NC/10K  R-0603  [R0603]
R132  NC/10K  R-0603  [R0603]
R133  0R  R-0603  [R0603]
R134  0R  R-0603  [R0603]
R135  0R  R-0603  [R0603]
R136  0R  R-0603  [R0603]
R137  0R  R-0603  [R0603]
R138  10K/NC  R-0603  [R0603]
R139  10K  R-0603  [R0603]
R140  200R  R-0603  [R0603]
R141  10R  R-0603  [R0603]
R142  0R/NC  R-0603  [R0603]
R143  10K  R-0603  [R0603]
R144  0R  R-0603  [R0603]
R145  100K  R-0603  [R0603]
R146  22.1K  R-0603  [R0603]
R147  0R  R-0603  [R0603]
R148  2.2K  R-0603  [R0603]
R149  NC  DISCRETE_R-0603  [DISCRETE_R0603]
R150  4.02K  R-0603  [R0603]
R151  10K  R-0603  [R0603]
R152  2.2K  R-0603  [R0603]
R153  0R  R-0603  [R0603]
R154  0R  R-0603  [R0603]
R155  0R  R-0603  [R0603]
R156  10K  DISCRETE_R-0603  [DISCRETE_R0603]
R157  10K  DISCRETE_R-0603  [DISCRETE_R0603]
R158  10K  DISCRETE_R-0603  [DISCRETE_R0603]
R159  10K  DISCRETE_R-0603  [DISCRETE_R0603]
R160  NC  DISCRETE_R-0603  [DISCRETE_R0603]
R161  NC  DISCRETE_R-0603  [DISCRETE_R0603]
R162  2.2K  R-0603  [R0603]
R163  0R  R-0603  [R0603]
R164  10K  R-0603  [R0603]
R165  150K  R-0603  [R0603]
R166  150K  R-0603  [R0603]
R167  0R  R-0603  [R0603]
R168  0R  R-0603  [R0603]
R169  470K  R-0603  [R0603]
R170  0R  R-0603  [R0603]
R171  0R  R-0603  [R0603]
R172  10K  DISCRETE_R-0603  [DISCRETE_R0603]
R173  51K  DISCRETE_R-0603  [DISCRETE_R0603]
R174  10K  DISCRETE_R-0603  [DISCRETE_R0603]
R175  51K  DISCRETE_R-0603  [DISCRETE_R0603]
R176  10K  DISCRETE_R-0603  [DISCRETE_R0603]
R177  51K  DISCRETE_R-0603  [DISCRETE_R0603]
R178  1.5K  R-0603  [R0603]
R179  1.5K  R-0603  [R0603]
R180  10K  DISCRETE_R-0603  [DISCRETE_R0603]
R181  51K  DISCRETE_R-0603  [DISCRETE_R0603]
R182  3.3K  R-0603  [R0603]
R183  2.2K  R-0603  [R0603]
R184  0R  R-0603  [R0603]
R185  0R  R-0603  [R0603]
R186  51K  DISCRETE_R-0603  [DISCRETE_R0603]
R187  51K  DISCRETE_R-0603  [DISCRETE_R0603]
R188  51K  DISCRETE_R-0603  [DISCRETE_R0603]
R189  51K  DISCRETE_R-0603  [DISCRETE_R0603]
R190  51K  DISCRETE_R-0603  [DISCRETE_R0603]
R191  10K  DISCRETE_R-0603  [DISCRETE_R0603]
R192  51K  DISCRETE_R-0603  [DISCRETE_R0603]
R193  10K  DISCRETE_R-0603  [DISCRETE_R0603]
R194  51K  DISCRETE_R-0603  [DISCRETE_R0603]
R195  51K  DISCRETE_R-0603  [DISCRETE_R0603]
R196  NC  R-0603  [R0603]
R197  2.2K  R-0603  [R0603]
R198  2.2K  R-0603  [R0603]
R199  4.7K  R-0603  [R0603]
R200  47K  R-0603  [R0603]
R207  22R  R-0603  [R0603]
R208  22R  R-0603  [R0603]
R209  22R  R-0603  [R0603]
R210  5.1K  R-0603  [R0603]
R211  5.1K  R-0603  [R0603]
R212  22R  R-0603  [R0603]
R213  22R  R-0603  [R0603]
R214  4.7K  R-0603  [R0603]
R215  47K  R-0603  [R0603]
R216  1K  R-0603  [R0603]
R217  0R  R-0603  [R0603]
R218  1.2K  R-0603  [R0603]
R219  100R  R-0603  [R0603]
R220  47K  R-0603  [R0603]
R221  30K  R-0603  [R0603]
R222  10K  R-0603  [R0603]
R223  30K  R-0603  [R0603]
R224  10K  R-0603  [R0603]
R225  30K  R-0603  [R0603]
R226  10K  R-0603  [R0603]
R227  30K  R-0603  [R0603]
R228  10K  R-0603  [R0603]
R230  1K  R-0603  [R0603]
R231  1K  R-0603  [R0603]
R232  0R  R-0603  [R0603]
R235  0R  R-0603  [R0603]
R236  0.4R  RESISTOR1206  [1206]
R237  0.4R  RESISTOR1206  [1206]
R238  1.2K  R-0603  [R0603]
R239  50K  R-0603  [R0603]
R240  3R  R-0603  [R0603]
R241  0.1R  DISCRETE_R-2512  [DISCRETE_R2512]
R242  0.1R  DISCRETE_R-2512  [DISCRETE_R2512]
R243  5.76K  R-0603  [R0603]
R244  150K  R-0603  [R0603]
RST  TS24CA  [2*4*3.5MM]
RX  TEST-POINT'4545'  [TP-D45MIL]
SD  HOLDER-MICROSD-9P  [9P-SMD-W/-RING]
SIM  MICROSIM  [MICROSIM]
SPK  1X2P  [1X2P-SMT1.25MM]
STA  NET  LEDCHIP-LED0805  [CHIP-LED0805]
TX  TEST-POINT'4545'  [TP-D45MIL]
U1  ESP32-C6-MINI-1  [ESP32-C6-MINI-1]
U2  MT9201  RY3730  [SOT23-6]
U3  CH340K  [ESOP-10-EP-150MIL]
U4  MP2143DJ-LF-Z  [TSOT23-8]
U5  SPX3819  [SOT23-5]
U7  AMS1117-3.3V  LD1117'SOT89'  [SOT89]
U8  ESP32-P4  [QFN105-35P-500L500W]
U9  W25Q128JV  [SOIC-8-208MIL]
U10  SPX3819  [SOT23-5]
U11  TLV62569DBVR  [SOT23-5-95P-300L300W]
U12  ES8311  [QFN20-40P-300L300W55H]
U13  IP101GRI  [QFN32-40P-400W400L]
U14  SPX3819  [SOT23-5]
U15  SPX3819  [SOT23-5]
U16  SPX3819  [SOT23-5]
U17  TLV62569DBVR  [SOT23-5-95P-300L300W]
U18  A7670G  [A7670G]
U19  TP5100  [QFN17-65P-400L400W80H]
U20  NS4150B  [MSOP8-65P-490L300W110H]
UN  PAD-TEST-POINT-CIRCLE'4545'  [TP_4545]
UP  PAD-TEST-POINT-CIRCLE'4545'  [TP_4545]
USB-CDC/JTAG  USB_C5  [USB-C-16P-5]
USB-DEVICE  USB_C5  [USB-C-16P-5]
USB-LTE  USB_C5  [USB-C-16P-5]
USB-NATIVE  USB_C5  [USB-C-16P-5]
USB-OTG  USB_C5  [USB-C-16P-5]
USB-TTL  USB_C5  [USB-C-16P-5]
VPWR  PAD-TEST-POINT-CIRCLE'4545'  [TP_4545]
X1  40MHz(10ppm)  XTAL-4-3225  [NX3225]
X2  25MHz(10ppm)  XTAL-4-3225  [NX3225]
X3  24MHz  CRYSTAL-OSCILLATOR2.5*2.0  [OSC4-SMD-2.5X2.0X0.8MM]

## Nets
1.8V: 1V8.T C208.2 C209.2 D6.+ Q33.1(G) Q34.1(G) Q35.1(G) Q36.1(G) R222.2 R224.2 R226.2 R228.2 U18.15(VDD_EXT) U18.97(NC)
3.3V: C5.1 C9.1 C16.2 C17.2 C22.1 C23.2 C24.2 C29.2 C30.2 P1.1 R1.2 R36.2 R42.2 R44.2 R47.2 R57.2 R63.2 R66.2 R67.2 R155.1 R186.2 R187.2 R188.2 R189.2 R190.2 U1.3(3V3)
25M_XI: C117.2 U13.2(X1) X2.3(X2)
25M_XO: C116.1 U13.3(X2) X2.1(X1)
+3V3: C3.2 C18.2 C19.2 C20.1 C25.1 C27.1 C42.1 C46.2 C47.2 C60.2 C66.2 C159.2 C184.1 C185.2 J1.3 J2.3 J8.1 J8.2 J8.3 J8.6 P2.5 P4.1 PWR.A R22.2 R48.2 R63.1 R149.2 R151.2 R156.2 R182.2 R217.2 R221.2 R223.2 R225.2 R227.2 U3.7(VCC) U3.10(V3) U5.5(VOUT) U14.1(VIN) U14.3(EN) U15.1(VIN) U15.3(EN) U16.1(VIN) X3.1(ENABLE) X3.4(VDD)
A3V3: C137.1 C139.2 FB3.2 R133.2 U10.5(VOUT)
ADCVREF: C126.2 R140.1 U12.15(ADCVREF)
AGND: C118.2 C119.2 C120.2 C121.2 C126.1 C127.1 C128.2 C131.2 C132.2 C135.2 C140.2 C141.2 C142.2 C143.2 C144.2 C146.2 C148.2 C149.1 C161.1 C162.2 C163.2 C164.2 MIC.2(GND) MIC.3(GND) R137.1 R139.2 R163.1 R164.1 U12.5(DGND) U12.10(AGND) U12.21(GND) U20.7(GND) ; supply symbol labelled GND_POWER
ANT: C53.2 R64.1 U18.60(RF_ANT)
AVDD: C121.1 R133.1 U12.11(AVDD)
BAT: FB2.1 R141.1
BOOT: BOOT1.2 U18.6(USB_BOOT)
C6_EN: C1.1 C6_EN.T C6_RST.3 C6_RST.4 P1.6 R66.1 R171.2 U1.8(EN)
C6_IO2: R68.1 U1.5(IO2)
C6_U0RXD: C6_U0RXD.T P1.4 U1.30(RX0/IO17)
C6_U0TXD: C6_U0TXD.T P1.3 U1.31(TX0/IO16)
CCLK: C87.2 J4.14 R142.1 R144.1
CODEC_CE: R138.2 R139.1 U12.20(CE)
COL: R119.2 R120.1 U13.4(COL/RMII)
CRS: R115.2 R116.1 U13.20(LEDMOD/CRS)
CSI_1V8: C31.1 C32.2 J4.16 R148.2 R183.2 R185.1 R197.2 R198.2 U15.5(VOUT)
CSI_2V8: C21.1 C108.2 J4.23 J4.24 U14.5(VOUT)
CSI_A_CLKN: J4.6 R104.2
CSI_A_CLKP: J4.7 R105.2
CSI_A_DATA0N: J4.9 R107.2
CSI_A_DATA0P: J4.10 R106.2
CSI_A_DATA1N: J4.3 R34.2
CSI_A_DATA1P: J4.4 R103.2
CSI_REXT: R150.1 U8.48(CSI_REXT)
CSI_RST: C88.2 CSI_RST.3 CSI_RST.4 J4.17 R46.1 R147.2 R149.1
CSI_SCL: J4.21 Q20.2(S) R183.1
CSI_SDA: J4.20 Q19.2(S) R148.1
D+: U3.1(UD+) USB-TTL.A6(D+) USB-TTL.B6(D+)
D-: U3.2(UD-) USB-TTL.A7(D-) USB-TTL.B7(D-)
DACVREF: C127.2 U12.14(DACVREF)
DSI_A_CLKN: J8.14 R98.1
DSI_A_CLKP: J8.15 R99.1
DSI_A_DATA0N: J8.11 R109.1
DSI_A_DATA0P: J8.12 R100.1
DSI_A_DATA1N: J8.17 R97.1
DSI_A_DATA1P: J8.18 R96.1
DSI_REXT: R95.1 U8.34(DSI_REXT)
DTR: Q3.2(E) R26.2 U3.4(DTR#)
EAR_N: U18.41(EAR_N)
EAR_P: U18.40(EAR_P)
EN_DCDC: R196.1 U8.79(EN_DCDC) U17.1(EN)
ESP_EN: C8.2 Q4.3(C) R16.1 RST.2 U8.103(CHIP_PU)
FB_DCDC: C151.2 R43.1 R169.2 U8.78(FB_DCDC) U17.5(FB)
FLASH_CK_A: R93.1 U9.6(CLK)
FLASH_CS_A: R89.1 R108.2 U9.1(/CS)
FLASH_D_A: R94.1 U9.5(DI(IO0))
FLASH_HD_A: R92.1 U9.7(/HOLD/RESET(IO3))
FLASH_Q_A: R90.1 U9.2(DO(IO1))
FLASH_WP_A: R91.1 U9.3(/WP(IO2))
GND: BAT1.- BAT.3 BAT.4 BAT.- BOOT.1 BOOT.3 BOOT.4 C1.2 C2.1 C3.1 C4.1 C5.2 C6.1 C6_BOOT.1 C6_BOOT.2 C6_RST.1 C6_RST.2 C7.1 C8.1 C9.2 C10.1 C11.1 C12.1 C13.1 C14.1 C15.1 C16.1 C17.1 C18.1 C19.1 C20.2 C21.2 C22.2 C23.1 C24.1 C25.2 C26.1 C27.2 C28.2 C29.1 C30.1 C31.2 C32.1 C34.2 C35.1 C41.2 C42.2 C43.1 C45.2 C46.1 C47.1 C48.1 C49.1 C50.1 C51.1 C52.2 C53.1 C54.1 C55.1 C60.1 C62.1 C63.1 C64.2 C65.2 C66.1 C67.1 C69.2 C70.1 C71.2 C72.2 C73.2 C74.2 C75.2 C76.2 C77.2 C78.2 C79.2 C80.2 C81.2 C82.2 C83.2 C84.2 C85.2 C86.2 C87.1 C88.1 C89.2 C90.2 C91.2 C92.2 C93.2 C94.2 C95.2 C96.2 C97.2 C98.2 C99.2 C100.2 C101.2 C102.2 C103.2 C104.2 C105.2 C106.2 C107.2 C108.1 C109.2 C110.2 C111.2 C114.2 C115.2 C116.2 C117.1 C122.2 C123.2 C133.2 C134.2 C136.2 C137.2 C138.1 C139.1 C150.1 C152.2 C153.1 C154.2 C155.2 C156.2 C157.2 C159.1 C165.2 C166.1 C168.2 C169.1 C170.2 C171.2 C172.2 C173.2 C174.2 C175.2 C176.2 C177.2 C178.2 C179.2 C180.2 C181.2 C182.2 C183.2 C184.2 C185.1 C190.1 C191.2 C192.2 C193.1 C194.1 C195.C(-) C196.1 C197.1 C199.2 C200.1 C201.1 C202.1 C203.1 C204.C(-) C205.1 C206.1 C207.1 C208.1 C209.1 C210.1 C211.1 C212.1 C219.1 C220.2 C221.2 C222.2 C223.2 C224.2 C225.2 C226.2 C227.2 CSI_RST.1 CSI_RST.2 D2.+ D3.A D4.2(A) D5.A D7.+ D8.A D10.2(A) D13.+ GPS.GND1 GPS.GND2 GPS.GND3 J1.4 J1.SS1 J1.SS2 J2.4 J2.SS1 J2.SS2 J4.5 J4.8 J4.13 J4.15 J4.19 J4.22 J4.25 J4.26 J6.9 J6.10 J6.25 J6.26 J6.39 J6.40 J8.4 J8.7 J8.10 J8.13 J8.16 J8.19 J8.22 J8.23 J8.32 J8.33 J10.5 J10.6 J10.13 J10.14 J10.19 J10.20 J10.29 J10.30 J10.33 J10.34 LTE.GND1 LTE.GND2 LTE.GND3 M1.1 M2.1 M3.1 M4.1 M5.1 M6.1 M7.1 M8.1 M9.1 P1.2 P2.4 P2.7 P2.8 P4.2 P4.7 P4.8 PWK.1 Q7.2(E) Q29.2(S) Q30.2(S) Q31.2(S) Q32.2(S) R10.1 R12.1 R13.1 R14.1 R15.1 R19.1 R27.1 R31.1 R32.1 R33.1 R37.2 R38.1 R49.1 R51.1 R52.1 R53.1 R58.1 R60.1 R70.1 R72.1 R73.1 R95.2 R113.1 R115.1 R117.1 R119.1 R121.1 R122.1 R131.1 R137.2 R146.1 R150.2 R159.1 R161.1 R169.1 R172.1 R173.1 R174.1 R175.1 R176.1 R177.1 R178.1 R180.1 R181.1 R191.1 R192.1 R193.1 R194.1 R195.1 R200.1 R210.1 R211.1 R215.1 R216.2 R220.1 R239.2 R243.1 RST.1 RST.3 RST.4 SD.6(VSS) SD.G1 SD.G2 SD.G3 SD.G4 SIM.5(GND) SPK.3 SPK.4 U1.1(GND) U1.2(GND) U1.11(GND) U1.14(GND) U1.36(GND) U1.37(GND) U1.38(GND) U1.39(GND) U1.40(GND) U1.41(GND) U1.42(GND) U1.43(GND) U1.44(GND) U1.45(GND) U1.46(GND) U1.47(GND) U1.48(GND) U1.49.1(GND) U1.49.2(GND) U1.49.3(GND) U1.49.4(GND) U1.49.5(GND) U1.49.6(GND) U1.49.7(GND) U1.49.8(GND) U1.49.9(GND) U1.50(GND) U1.51(GND) U1.52(GND) U1.53(GND) U2.2(GND) U3.3(GND) U3.EP U4.4(PGND) U4.6(AGND) U5.2(GND) U7.1(GND) U8.105(GND) U8.106(GND) U8.107(GND) U8.108(GND) U8.109(GND) U8.110(GND) U8.111(GND) U8.112(GND) U8.113(GND) U9.4(GND) U10.2(GND) U11.2(GND) U13.33(EP) U14.2(GND) U15.2(GND) U16.2(GND) U17.2(GND) U18.2(GND) U18.17(GND) U18.18(GND) U18.29(GND) U18.39(GND) U18.45(GND) U18.46(GND) U18.54(GND) U18.58(GND) U18.59(GND) U18.61(GND) U18.62(GND) U18.63(GND) U18.64(GND) U18.65(GND) U18.69(GND) U18.70(GND) U18.71(GND) U18.72(GND) U18.73(GND) U18.74(GND) U18.75(GND) U18.76(GND) U18.77(GND) U18.78(GND) U18.79(GND) U18.80(GND) U18.81(GND) U18.82(GND) U18.83(GND) U18.84(GND) U18.85(GND) U18.86(GND) U18.87(GND) U18.88(GND) U18.89(GND) U18.91(GND) U18.92(GND) U18.94(GND) U19.7(GND) U19.17(EP) USB-CDC/JTAG.GND USB-CDC/JTAG.GND2(GND) USB-DEVICE.GND USB-DEVICE.GND2(GND) USB-LTE.GND USB-LTE.GND2(GND) USB-LTE.SHLD1(SHLD) USB-LTE.SHLD2(SHLD) USB-LTE.SHLD3(SHLD) USB-LTE.SHLD4(SHLD) USB-LTE.SHLD5(SHLD) USB-LTE.SHLD6(SHLD) USB-LTE.SHLD7(SHLD) USB-LTE.SHLD8(SHLD) USB-NATIVE.GND USB-NATIVE.GND2(GND) USB-OTG.GND USB-OTG.GND2(GND) USB-TTL.GND USB-TTL.GND2(GND) X1.2(G2) X1.4(G1) X2.2(G2) X2.4(G1) X3.2(GND)
GNSS_PWR_EN: U18.20(MK_IN_3) U18.98(NC)
I2C_SCL: C134.1 P2.1 P4.4 Q20.3(D) R42.1 R154.2 R182.1 U12.1(CCLK)
I2C_SDA: C133.1 P2.2 P4.3 Q19.3(D) R47.1 R48.1 R153.2 U12.19(CDATA)
I2S_ASDOUT: R76.1 U12.7(ASDOUT)
I2S_DSDIN: R74.1 U12.9(DSDIN)
I2S_LRCK: C120.1 R75.1 U12.8(LRCK)
I2S_MCLK: C118.1 R78.1 U12.2(MCLK)
I2S_SCLK: C119.1 R77.1 U12.6(SCLK)
IO0: C85.1 J6.23 J6.24 Q2.P$1 U8.104(GPIO0)
IO1: C86.1 J10.21 J10.22 Q2.P$2 R142.2 U8.1(GPIO1)
IO2: J6.21 J6.22 Q36.3(D) R46.2 R227.1 U8.2(GPIO2)
IO3: J1.1 J6.19 J6.20 U8.3(GPIO3)
IO4: J1.2 J10.17 J10.18 U8.4(GPIO4)
IO5: J10.15 J10.16 U8.5(GPIO5)
IO6: J6.15 J6.16 R68.2 U8.6(GPIO6)
IO7: J6.3 J6.4 R153.1 U8.7(GPIO7)
IO8: J6.5 J6.6 R154.1 U8.8(GPIO8)
IO9: R74.2 U8.10(GPIO9)
IO9/BOOT: C6_BOOT.3 C6_BOOT.4 C6_IO9.T P1.5 U1.23(IO9)
IO10: R75.2 U8.11(GPIO10)
IO11: R76.2 U8.12(GPIO11)
IO12: R77.2 U8.13(GPIO12)
IO12/USB_N: U1.17(USB_D-/IO12) UN.T
IO13: R78.2 U8.14(GPIO13)
IO13/USB_P: U1.18(USB_D+/IO13) UP.T
IO14: R79.2 U8.15(GPIO14)
IO15: R80.2 U8.16(GPIO15)
IO16: R81.2 U8.17(GPIO16)
IO17: R82.2 U8.18(GPIO17)
IO18: R83.2 U8.19(GPIO18)
IO19: R84.2 U8.20(GPIO19)
IO20: J2.1 J6.13 J6.14 U8.22(GPIO20)
IO21: J2.2 J6.11 J6.12 U8.23(GPIO21)
IO22: J10.11 J10.12 R35.1 U8.24(GPIO22)
IO23: J6.7 J6.8 R3.1 R59.2 U8.25(GPIO23)
IO24: R101.1 U8.52(GPIO24)
IO25: R110.1 U8.53(GPIO25)
IO26: J6.31 J6.32 R111.1 U8.55(GPIO26)
IO27: J10.37 J10.38 R112.1 U8.56(GPIO27)
IO28: U8.57(GPIO28) U13.19(FX_HEN/CRS_DV/RXDV)
IO29: U8.58(GPIO29) U13.18(RXD0)
IO30: U8.60(GPIO30) U13.17(RXD1)
IO31: R88.1 U8.61(GPIO31) U13.22(MDC)
IO32: J10.25 J10.26 Q35.3(D) R225.1 U8.63(GPIO32)
IO33: J6.29 J6.30 R214.2 U8.64(GPIO33)
IO34: IO34.T U8.65(GPIO34) U13.9(TXD0)
IO35: BOOT.2 IO35.T Q3.3(C) R22.1 U8.66(GPIO35) U13.8(TXD1)
IO36: IO36.T J10.23 J10.24 R151.1 U8.68(GPIO36)
IO37: IO37.T J10.7 J10.8 R17.1 U8.69(GPIO37)
IO38: IO38.T J10.9 J10.10 R2.1 U8.70(GPIO38)
IO45: J10.39 J10.40 R71.1 U8.87(GPIO45)
IO46: J10.35 J10.36 R199.2 U8.88(GPIO46)
IO47: J6.37 J6.38 Q33.3(D) R221.1 U8.89(GPIO47)
IO48: J6.33 J6.34 Q34.3(D) R223.1 U8.90(GPIO48)
IO49: U8.92(GPIO49) U13.5(TXEN)
IO50: U8.93(GPIO50) U13.10(TXCLK/50M_CLKI) U13.14(RXCLK/50M_CLKO)
IO51: R131.2 R132.1 U8.94(GPIO51) U13.32(RESET_N)
IO52: R87.1 U8.95(GPIO52) U13.23(MDIO)
IO53: J6.35 J6.36 R170.1 U8.97(GPIO53)
IO54: J10.31 J10.32 R171.1 U8.98(GPIO54)
LCD_RST: C15.2 J8.5 R1.1
LCD_VDD: C26.2 C28.1 R157.2 R158.2 R160.2 R185.2 U16.5(VOUT)
LED+: C11.2 C12.2 C68.2 D1.- D+.T J3.1 J8.29 J8.30 J8.31 U2.5(OVP)
LED-: C68.1 D-.T J3.2 J8.24 J8.25 J8.26 J8.27 R32.2 R33.2 U2.3(FB)
LTE_DTR: Q36.2(S) R228.1 U18.3(DTR)
LTE_RI: Q35.2(S) R226.1 U18.4(RI)
LTE_RXD: Q34.2(S) R224.1 U18.10(RXD)
LTE_TXD: Q33.2(S) R222.1 U18.9(TXD)
LTE_USB_DN: R213.1 U18.28(USB_DM)
LTE_USB_DP: R212.1 U18.27(USB_DP)
MF_GNSS_RXD: R230.2 U18.49(UART3_RXD)
MF_GNSS_TXD: R231.2 U18.50(UART3_TXD)
MIC_N: U18.43(MIC_N)
MIC_P: U18.42(MIC_P)
MICN: C130.2 R162.1 R163.2
MICP: C129.2 C160.2 R152.1
MKF_3V1: C107.1 C109.1 U13.28(REGOUT)
MKF_3V3: C71.1 C72.1 C73.1 C89.1 C90.1 C92.1 C99.1 C105.1 C106.1 C158.2 C161.2 C164.1 C167.1 C168.1 C169.2 FB1.2 FB4.1 J6.1 J6.2 J6.17 J6.18 L4.P$2 MIC.1(VDD) Q1.2(S) R41.1 R69.2 R102.1 R136.1 R138.1 R145.2 R155.2 U8.9(VDD_LP) U8.21(VDD_IO_0) U8.62(VDD_IO_4) U8.75(VDD_LDO) U8.77(VDD_DCDCC) U8.96(VDD_IO_6) U8.101(VDD_ANA)
MKF_LDO_VO1: C93.1 R56.1 U8.71(VDDO_FLASH)
MKF_LDO_VO2: C94.1 C97.1 C98.1 U8.59(VDD_PSRAM_0) U8.67(VDD_PSRAM_1) U8.72(VDDO_PSRAM)
MKF_LDO_VO3: C78.1 C79.1 C95.1 C101.1 U8.41(VDD_MIPI_DPHY) U8.73(VDDO_3)
MKF_LDO_VO4: C54.2 C96.1 C102.1 C103.1 R4.2 R5.2 R6.2 R7.2 R8.2 R9.2 U8.74(VDDO_4) U8.85(VDD_IO_5)
MKF_VBAT: C83.1 C84.1 FB2.2 FB4.2 R16.2 U8.102(VDD_BAT)
MKF_VDD_HP: C74.1 C75.1 C91.1 C104.1 C151.1 C152.1 C153.2 L3.P$2 R43.2 U8.26(VDD_HP_0) U8.54(NC) U8.76(VDD_HP_2) U8.91(VDD_HP_3)
N$1: L2.1 U4.3(SW)
N$2: Q4.1(B) R26.1
N$3: Q3.1(B) R25.1
N$4: C61.1 R10.2 R11.1 U4.7(FB)
N$5: R38.2 USB-CDC/JTAG.A5(CC1)
N$6: R15.2 USB-NATIVE.A5(CC1)
N$7: PWR.C R19.2
N$8: R18.1 U4.1(PG)
N$9: R24.1 U4.8(EN)
N$10: R13.2 USB-TTL.A5(CC1)
N$11: R12.2 USB-TTL.B5(CC2)
N$12: Q29.1(G) R30.1 R49.2
N$13: NET.A R29.1
N$14: R14.2 USB-NATIVE.B5(CC2)
N$15: NET.C Q29.3(D)
N$16: C55.2 R64.2 R184.1
N$17: D1.+ L1.P$2 R23.2 U2.1(LX)
N$18: R27.2 USB-CDC/JTAG.B5(CC2)
N$19: D13.- LTE.D R184.2
N$20: R53.2 USB-OTG.A5(CC1)
N$21: C34.1 C150.2 R41.2 R196.2 U17.4(VIN)
N$22: C2.2 R23.1
N$23: L3.P$1 U17.3(SW)
N$24: Q7.3(C) R31.2 R39.1 U2.4(EN)
N$25: R51.2 USB-OTG.B5(CC2)
N$26: Q22.1(B) Q22.3(C) Q23.1(B) R191.2
N$27: Q21.1(G) Q23.3(C) R192.2
N$28: R67.1 U1.22(IO8)
N$29: Q7.1(B) R59.1 R60.2
N$35: R73.2 USB-DEVICE.A5(CC1)
N$36: C158.1 Q1.1(G) R69.1 R70.2 R71.2
N$37: R72.2 USB-DEVICE.B5(CC2)
N$38: R144.2 X3.3(OUT)
N$39: R156.1 U16.3(EN)
N$40: BAT1.+$1(+) BAT1.+$2(+1) R141.2
N$41: C160.1 C163.1 L5.2
N$42: C130.1 U12.17(MIC1N)
N$43: C162.1 L5.1 MIC.4(OUT)
N$44: C167.2 R145.1 R146.2 U11.5(FB)
N$45: C122.1 C125.1 U12.12(OUTP)
N$46: R17.2 U3.9(RXD)
N$47: C123.1 C124.1 U12.13(OUTN)
N$48: C124.2 R134.1
N$49: R2.2 U3.8(TXD)
N$50: C125.2 R135.1
N$51: C129.1 U12.18(MIC1P)
N$52: C131.1 C132.1 R136.2 U12.3(PVDD) U12.4(DVDD)
N$53: C135.1 R140.2 R152.2 R162.2
N$54: C140.1 U20.2(BYPASS)
N$55: C141.1 C142.1 C143.1 FB5.1 U20.6(VCC)
N$56: C145.2 R165.1
N$57: C147.2 R166.1
N$58: C33.2 C149.2 R168.2 SPK.2
N$59: C33.1 C148.1 R167.2 SPK.1
N$60: R143.1 U11.1(EN)
N$61: Q11.1(B) Q11.3(C) Q12.1(B) R174.2
N$62: L4.P$1 U11.3(SW)
N$63: R89.2 U8.27(FLASH_CS)
N$64: R90.2 U8.28(FLASH_Q)
N$65: R91.2 U8.29(FLASH_WP)
N$66: Q8.1(B) Q8.3(C) Q9.1(B) R172.2
N$67: R92.2 U8.31(FLASH_HOLD)
N$68: R93.2 U8.32(FLASH_CK)
N$69: R94.2 U8.33(FLASH_D)
N$70: C154.1 J7.6(CT2)
N$71: R96.2 U8.35(DSI_DATAP1)
N$72: R97.2 U8.36(DSI_DATAN1)
N$73: R98.2 U8.37(DSI_CLKN)
N$74: R99.2 U8.38(DSI_CLKP)
N$75: R100.2 U8.39(DSI_DATAP0)
N$76: C45.1 U5.4(BYP)
N$77: C155.1 J7.5(CT1)
N$78: C80.1 C81.1 C82.1 R102.2 U8.51(VDD_USBPHY)
N$79: C156.1 J7.10(CGND)
N$80: C157.1 J7.13 J7.14
N$81: J7.11(LED-) R178.2
N$82: R103.1 U8.47(CSI_DATAP1)
N$83: R34.1 U8.46(CSI_DATAN1)
N$84: R104.1 U8.45(CSI_CLKN)
N$85: R105.1 U8.44(CSI_CLKP)
N$86: R106.1 U8.43(CSI_DATAP0)
N$87: R107.1 U8.42(CSI_DATAN0)
N$88: R109.2 U8.40(DSI_DATAN0)
N$89: J7.2(LED1-) R179.1
N$90: Q5.1(G) Q9.3(C) R173.2
N$91: Q10.1(G) Q12.3(C) R175.2
N$92: Q14.1(B) Q14.3(C) Q15.1(B) R176.2
N$93: Q13.1(G) Q15.3(C) R177.2
N$94: Q17.1(B) Q17.3(C) Q18.1(B) R180.2
N$95: Q16.1(G) Q18.3(C) R181.2
N$96: Q30.1(G) R199.1 R200.2
N$97: Q25.1(B) Q25.3(C) Q26.1(B) R193.2
N$98: Q24.1(G) Q26.3(C) R194.2
N$100: Q6.1(G) Q28.3(C) R195.2
N$101: Q20.1(G) R198.1
N$102: R124.1 U8.80(GPIO39)
N$103: R125.1 U8.81(GPIO40)
N$104: R126.1 U8.82(GPIO41)
N$105: R127.1 U8.83(GPIO42)
N$106: R128.1 U8.84(GPIO43)
N$107: Q19.1(G) R197.1
N$108: R129.1 U8.86(GPIO44)
N$110: Q27.1(B) Q27.3(C) Q28.1(B) R58.2
N$117: R207.1 U18.31(USIM1_DATA)
N$118: R208.1 U18.32(USIM1_CLK)
N$119: R209.1 U18.33(USIM1_RST)
N$120: R211.2 USB-LTE.A5(CC1)
N$121: R210.2 USB-LTE.B5(CC2)
N$122: R212.2 USB-LTE.A6(D+) USB-LTE.B6(D+)
N$123: R213.2 USB-LTE.A7(D-) USB-LTE.B7(D-)
N$124: Q31.1(G) R214.1 R215.2
N$125: BOOT1.1 R216.1
N$126: C199.1 L6.1 R217.1
N$127: C198.1 GPS.D L6.2
N$128: C198.2 U18.90(NC)
N$129: Q32.1(G) R219.1 R220.2
N$130: R218.1 STA.A
N$131: Q32.3(D) STA.C
N$134: R230.1 U18.95(NC)
N$135: R231.1 U18.96(NC)
N$137: C219.2 D6.- U18.116(NC)
N$138: C220.1 C221.1 R236.1 R237.1 R238.1 U19.1(VIN1) U19.4(VIN2) U19.5(VIN3) U19.16(VIN4)
N$139: CHRG.A DONE.A R238.2
N$140: CHRG.C U19.15(!CHRG)
N$141: DONE.C U19.14(!STDBY)
N$142: C222.1 R244.2 U19.10(VREG)
N$143: R239.1 U19.12(PTRICK)
N$144: D5.C L7.P$1 R240.1 U19.2(LX1) U19.3(LX2)
N$145: C224.1 C225.1 L7.P$2 R241.1 R242.1 U19.8(VS)
N$146: R243.2 R244.1 U19.11(TS)
N$147: C223.1 R240.2
NETLED: R30.2 U18.52(NETLIGHT)
NRST: D2.- Q31.3(D) U18.16(RESET)
OUTN: C146.1 C147.1 R134.2
OUTP: C144.1 C145.1 R135.2
PA_CTRL: R164.2 R170.2 U20.1(CTRL)
PA_INL+: R165.2 U20.3(IN+)
PA_INL-: R166.2 U20.4(IN-)
PA_OUTL+: R167.1 U20.8(OUT+)
PA_OUTL-: R168.1 U20.5(OUT-)
PHY_3V3: C110.1 C111.1 C114.1 C115.1 FB1.1 J7.1(LED1+) R87.2 R88.2 R114.2 R116.2 R118.2 R120.2 R123.2 R130.2 R132.2 U13.13(VDD_IO) U13.31(AVDD33)
PHY_AD0: R123.1 R179.2 U13.11(LED0/PHY_AD0)
PHY_AD3: J7.12(LED+) R122.2 U13.12(LED3/PHY_AD3)
PHY_ISET: R121.2 U13.25(ISET)
PHY_TESTON: R130.1 U13.24(TEST_ON)
PWRKEY: C205.2 PWK.2 Q30.3(D) U18.1(PWRKEY)
RD+: J7.7(RD+) U13.27(MDI_RP)
RD-: J7.8(RD-) U13.26(MDI_RN)
RESET: R147.1
RTS: Q4.2(E) R25.2 U3.6(RTS#)
RXER: R117.2 R118.1 U13.21(INTR_32/RXER)
SD1_CLK: D4.5(C4) R5.1 R128.2 SD.5(SCLK)
SD1_CMD: D4.3(C2) R4.1 R129.2 SD.3(DI)
SD1_D0: D4.6(C5) R6.1 R124.2 SD.7(DO)
SD1_D1: R9.1 R125.2 SD.8(DATA1)
SD1_D2: D4.1(C1) R7.1 R126.2 SD.1(DATA2)
SD1_D3: R8.1 R127.2 SD.2(CS)
SD1_VDD: C10.2 C14.2 D4.4(C3) Q1.3(D) R55.1 SD.4(VDD)
SD2_CLK: R83.1 R186.1 U1.25(SDIO_CLK/IO19)
SD2_CMD: R57.1 R84.1 U1.24(SDIO_CMD/IO18)
SD2_D0: R79.1 R187.1 U1.26(SDIO_D0/IO20)
SD2_D1: R80.1 R188.1 U1.27(SDIO_D1/IO21)
SD2_D2: R81.1 R189.1 U1.28(SDIO_D2/IO22)
SD2_D3: R82.1 R190.1 U1.29(SDIO_D3/IO23)
SD_DET: R55.2 SD.9(CDN)
SHLR: R159.2 R160.1
SIM_CLK: C211.2 D10.4(C3) R208.2 SIM.3(CLK)
SIM_DATA: C212.2 D10.3(C2) R207.2 SIM.7(I/O)
SIM_RST: C210.2 D10.5(C4) R209.2 SIM.2(RST)
SIM_VDD: C190.2 C200.2 D10.6(C5) SIM.1(VCC) U18.30(USIM1_VDD)
STATUS: R219.2 U18.66(STATUS)
STBYB: R157.1
TD+: J7.3(TD+) U13.30(MDI_TP)
TD-: J7.4(TD-) U13.29(MDI_TN)
TP_INT: P2.3 P4.5 R3.2 R36.1 R37.1
TP_RST: C13.2 P2.6 P4.6 R35.2 R44.1
TXER: R113.2 R114.1 U13.1(TXER/FXSD)
UART_LOG_RX: RX.T U18.22(UART_LOG_RX)
UART_LOG_TX: TX.T U18.23(UART_LOG_TX)
UPDN: R158.1 R161.2
USB1_5V: C170.1 C171.1 Q5.3(D) Q8.2(E) USB-NATIVE.VBUS1(VBUS) USB-NATIVE.VBUS2(VBUS)
USB1_D+: R20.1 USB-NATIVE.A6(D+) USB-NATIVE.B6(D+)
USB1_D-: R21.1 USB-NATIVE.A7(D-) USB-NATIVE.B7(D-)
USB1P1_N: R45.2 R101.2
USB1P1_N_2: R65.2 R111.2
USB1P1_P: R40.2 R110.2
USB1P1_P_2: R54.2 R112.2
USB2_5V: C172.1 C173.1 Q10.3(D) Q11.2(E) USB-CDC/JTAG.VBUS1(VBUS) USB-CDC/JTAG.VBUS2(VBUS)
USB2_D+: R40.1 USB-CDC/JTAG.A6(D+) USB-CDC/JTAG.B6(D+)
USB2_D-: R45.1 USB-CDC/JTAG.A7(D-) USB-CDC/JTAG.B7(D-)
USB3_5V: C174.1 C175.1 Q13.3(D) Q14.2(E) USB-OTG.VBUS1(VBUS) USB-OTG.VBUS2(VBUS)
USB3_D+: R54.1 USB-OTG.A6(D+) USB-OTG.B6(D+)
USB3_D-: R65.1 USB-OTG.A7(D-) USB-OTG.B7(D-)
USB4_5V: D12.C Q6.2(S) Q28.2(E) USB-DEVICE.VBUS1(VBUS) USB-DEVICE.VBUS2(VBUS)
USB4_D+: R85.1 USB-DEVICE.A6(D+) USB-DEVICE.B6(D+)
USB4_D-: R86.1 USB-DEVICE.A7(D-) USB-DEVICE.B7(D-)
USB_5V: C178.1 C179.1 Q5.2(S) Q9.2(E) Q10.2(S) Q12.2(E) Q13.2(S) Q15.2(E) Q16.2(S) Q18.2(E) Q21.3(D) Q22.2(E) R236.2 R237.2
USB_DM: R21.2 R86.2 U8.49(DM)
USB_DP: R20.2 R85.2 U8.50(DP)
V_BATT: C48.2 C49.2 C50.2 C61.2 C193.2 C194.2 C195.A(+) C196.2 C197.2 C201.2 C202.2 C203.2 C204.A(+) D7.- D8.C L2.2 R11.2 R29.2 R218.2 R232.1 R235.1 U4.5(OUT) U18.55(VBAT) U18.56(VBAT) U18.57(VBAT)
VBAT: BAT.+ C180.1 C181.1 C226.1 C227.1 Q24.3(D) Q25.2(E) R241.2 R242.2 U19.9(BAT)
VBAT_ADC: C52.1 R50.1 R52.2 U18.51(VBAT_ADC)
VBAT_IN: R50.2
VBUS: C4.2 C6.2 C7.2 C176.1 C177.1 Q16.3(D) Q17.2(E) USB-TTL.VBUS1(VBUS) USB-TTL.VBUS2(VBUS)
VCC_5V: C41.1 C43.2 C51.2 C62.2 C63.2 C64.1 C67.2 C136.1 C138.2 C165.1 C166.2 C182.1 C183.1 D12.A FB5.2 J10.1 J10.2 J10.3 J10.4 L1.P$1 PWR1.3 PWR1.3@1 Q6.3(D) Q27.2(E) R18.2 R24.2 R39.2 R143.2 U2.6(IN) U4.2(VIN) U5.1(VIN) U5.3(EN) U7.3(IN) U10.1(VIN) U10.3(EN) U11.4(VIN) VPWR.T
VDD: 3V.T C65.1 C206.2 C207.2 FB3.1 U7.2(OUT) U7.4(OUT) U18.99(VDD_AUX)
VDD_FLASH: C76.1 C77.1 C100.1 R56.2 R108.1 U8.30(VDD_FLASHIO) U9.8(VCC)
VIN: R232.2 R235.2
VMID: C128.1 U12.16(VMID)
VPP: C35.2 D3.C PWR1.2 PWR1.2@1 Q21.2(S) Q23.2(E) Q24.2(S) Q26.2(E)
VUSB: C191.1 C192.1 U18.24(VBUS) USB-LTE.VBUS1(VBUS) USB-LTE.VBUS2(VBUS)
XTAL_N: C70.2 U8.99(XTAL_N) X1.3(X2)
XTAL_P: C69.1 U8.100(XTAL_P) X1.1(X1)
Unconnected: D10.1(C1) J4.1 J4.2 J4.11 J4.12 J4.18 J6.27 J6.28 J7.9(NC) J8.8 J8.9 J8.20 J8.21 J8.28 J10.27 J10.28 PWR1.1 PWR1.1@1 SIM.6(VPP) U1.6(IO3) U1.9(MTMS/LP_RX/IO4) U1.10(MTDI/LP_TX/IO5) U1.12(XTAL_32K_P/IO0) U1.13(XTAL_32K_N/IO1) U1.15(MTCK/LP_SDA/IO6) U1.16(MTDO/LP_SCL/IO7) U1.19(IO14) U1.20(IO15) U3.5(CTS#) U10.4(BYP) U13.6(TXD3) U13.7(TXD2) U13.15(RXD3) U13.16(RXD2) U14.4(BYP) U15.4(BYP) U16.4(BYP) U18.5(DCD) U18.7(CTS) U18.8(RTS) U18.11(SPI_CLK) U18.12(SPI_CS) U18.13(SPI_MOSI) U18.14(SPI_MISO) U18.19(GPIO1) U18.21(MK_OUT_3) U18.25(ADC) U18.26(GPIO2) U18.34(USIM1_DET) U18.35(MK_OUT_6) U18.36(MK_IN_6) U18.37(I2C_SDA) U18.38(I2C_SCL) U18.44(MK_OUT_2) U18.47(MK_IN_2) U18.48(GPIO3) U18.53(GPIO4) U18.67(MK_OUT_5) U18.68(MK_IN_5) U18.93(NC) U18.100(NC) U18.101(LCD_BL_PWM) U18.102(LCD_SPI_CLK) U18.103(LCD_SPI_TXD) U18.104(LCD_SPI_RXD) U18.105(LCD_SPI_CS) U18.106(LCD_RST) U18.107(LCD_DCX) U18.108(USIM2_DATA) U18.109(USIM2_CLK) U18.110(USIM2_VDD) U18.111(USIM2_RST) U18.112(USIM2_DET) U18.113(NC) U18.114(NC) U18.115(NC) U18.117(CAM_I2C_SDA) U18.118(CAM_I2C_SCL) U18.119(CAM_PWDN) U18.120(CAM_RST) U18.121(CAM_MCLK) U18.122(CAM_SPI_D0) U18.123(CAM_SPI_D1) U18.124(CAM_SPI_CLK) U19.6(PWR_ON) U19.13(CS) USB-CDC/JTAG.SHLD1(SHLD) USB-CDC/JTAG.SHLD2(SHLD) USB-CDC/JTAG.SHLD3(SHLD) USB-CDC/JTAG.SHLD4(SHLD) USB-CDC/JTAG.SHLD5(SHLD) USB-CDC/JTAG.SHLD6(SHLD) USB-CDC/JTAG.SHLD7(SHLD) USB-CDC/JTAG.SHLD8(SHLD) USB-DEVICE.SHLD1(SHLD) USB-DEVICE.SHLD2(SHLD) USB-DEVICE.SHLD3(SHLD) USB-DEVICE.SHLD4(SHLD) USB-DEVICE.SHLD5(SHLD) USB-DEVICE.SHLD6(SHLD) USB-DEVICE.SHLD7(SHLD) USB-DEVICE.SHLD8(SHLD) USB-NATIVE.SHLD1(SHLD) USB-NATIVE.SHLD2(SHLD) USB-NATIVE.SHLD3(SHLD) USB-NATIVE.SHLD4(SHLD) USB-NATIVE.SHLD5(SHLD) USB-NATIVE.SHLD6(SHLD) USB-NATIVE.SHLD7(SHLD) USB-NATIVE.SHLD8(SHLD) USB-OTG.SHLD1(SHLD) USB-OTG.SHLD2(SHLD) USB-OTG.SHLD3(SHLD) USB-OTG.SHLD4(SHLD) USB-OTG.SHLD5(SHLD) USB-OTG.SHLD6(SHLD) USB-OTG.SHLD7(SHLD) USB-OTG.SHLD8(SHLD) USB-TTL.SHLD1(SHLD) USB-TTL.SHLD2(SHLD) USB-TTL.SHLD3(SHLD) USB-TTL.SHLD4(SHLD) USB-TTL.SHLD5(SHLD) USB-TTL.SHLD6(SHLD) USB-TTL.SHLD7(SHLD) USB-TTL.SHLD8(SHLD)

## Notes on the sheet
- 4G LTE
- IOs
- Charger
- GNSS_RXD | GNSS_TXD
- 4.5~12V
- Battery
- 3.4~4.2V/2A
- FXL0530-100-M
- Closer to Module
- USB
- USB Type C
- pps
- Max current 3A
- 4.2V | 3V
- 2.5~5.5V
- Vfb=0.6V
- Mic&Speak
- MCU
- 1.2V
- 0.6V
- 0x18
- CR1220
- 1V1~1V3
- ME6217
- key flash
- Camera
- Camera
- NC
- D1N
- D1P
- GND
- CKN
- CKP
- WiFi
- GND
- D0N
- D0P
- NC
- NC
- GND
- MCLK
- GND
- ESP32-C6
- 1.8V
- RST
- NC
- GND
- VDD Range:
  3.0V - 3.6V
- SDA
- SCL
- LCD | GND
- 2.8V | wake up
- 2.8V
- ME6217
- Level Shifter
- 1.8V
- 0.6V
- ME6217
- ME6217
- POWER | USB to UART
- Ethernet
- USB TO SERIAL CONVERTER
- LEDS
- ME6217
- 9.6V
- POWER AND FILTERING
- MIPI_DP3
- MIPI_DN3 | USB
- MIPI_DP2
- MIPI_DN2
- MIPI_CP
- MIPI_CN
- MIPI_DP1
- USB2.0 High Speed
- MIPI_DN1
- USB | USB Type C
- MIPI_DP0 | USB
- MIPI_DN0
- STBYB
- LRSTB
- VDD | 1.8V
- VDD
- VCOM | 3.7V
- Backlight:180mA
- USB Type C
- USB Type C
- 2.5~5.5V
- USB2.0 Full-Speed
- Closer to IC
- USB
- USB
- HC632701A-M906-A
- Mabee
- Back Light
- USB Type C
- Closer to IC
- USB Type C
- Touch
- Switch
- MaTouch ESP32-P4 TFT with 4G LTE  Touch 10.1" MIPI V1.0
- www.makerfabs.com
- Design by Charlin
- Down Contact
- GT911
- TF Card
- SDIO 3.0
- Zener
- D3
- CMD
- CLK
- D0

## Library data of the parts
1V8 3V D+ D- IO34-IO38 RX TX = Discrete-new:TEST-POINT; PARTNO: DNP
BAT = Connector-new:JST-2P-SMD: 2P-SMD-1.0-90D:320110054;2P-SMD-2.0-90D:320110026
BAT1 = adafruit:CR1220: CR1216/CR1220/CR1225 12mm 3V lithium coin cell Great for battery packup. Both SMT and THM holders. Note the THM package has the ground pads on both sides of the PCB so that the masks are the same - this reduces the cost
BOOT RST = sale:TS24CA
BOOT1 PWK = SparkFun-Switches:MOMENTARY-SWITCH-SPST: Momentary Switch (Pushbutton) - SPST Normally-open (NO) SPST momentary switches (buttons, pushbuttons). Variants PTH-12MM - 12mm square, through-hole Momentary Pushbutton Switch - 12mm Square <https://www.sparkfun.com/products/9190> (COM-09190) PTH-6.0MM, PTH-6.0MM-KIT - 6.0mm square, through-hole Mini Pushbutton Switch <https://www.sparkfun.com/products/97> (COM-00097) KIT package intended for soldering kit's - only one side of pads' copper is exposed. PTH-RIGHT-ANGLE-KIT - Right-angle, through-hole Right Angle Tactile Button <https://www.sparkfun.com/products/10791> - Used on SparkFun BigTime Watch Kit <https://www.sparkfun.com/products/11734> SMD-12MM - 12mm square, surface-mount Tactile Button - SMD (12mm) <https://www.sparkfun.com/products/12993> (COM-12993) Used on SparkFun PicoBoard <https://www.sparkfun.com/products/11888> SMD-4.5MM - 4.5mm Square Trackball Switch Used on SparkFun Blackberry Trackballer Breakout <https://www.sparkfun.com/products/13169> SMD-4.6MMX2.8MM - 4.60mm x 2.80mm, surface mount Used on SparkFun SAMD21 Mini Breakout <https://www.sparkfun.com/products/13664> SMD-5.2MM, SMD-5.2-REDUNDANT - 5.2mm square, surface-mount Mini Pushbutton Switch - SMD <https://www.sparkfun.com/products/8720> (COM-08720) Used on Arduino Pro Mini <https://www.sparkfun.com/products/11114> REDUNDANT package connects both switch circuits together SMD-6.0X3.5MM - 6.0 x 3.5mm, surface mount Momentary Reset Switch SMD <https://www.sparkfun.com/products/8229> (COM-08229) SMD-6.2MM-TALL - 6.2mm square, surface mount Tactile Button - SMD (6mm) <https://www.sparkfun.com/products/12992> Used on SparkFun Digital Sandbox <https://www.sparkfun.com/products/12651> SMD-RIGHT-ANGLE - Right-angle, surface mount Used on SparkFun Block for Intel® Edison - Arduino <https://www.sparkfun.com/products/13036>; PROD_ID: SWCH-00815; SF_SKU: COM-08229
C1 C5 C9 C20-C22 C25 C27 C28 C31 C33-C35 C41-C43 C45 C48-C53 C55 C61-C65 C67 C71-C84 C89-C107 C109-C111 C114 C115 C118-C157 C165-C184 C190-C194 C196-C203 C205-C212 C219-C227 = Discrete:C*: Ceramic Capacitors
C2-C4 C6-C8 C10-C19 C23 C24 C26 C29 C30 C32 C46 C47 C54 C60 C66 C68-C70 C85-C88 C108 C116 C117 C158 C185 = A9G:DISCRETE_C*: Ceramic Capacitors
C6_BOOT C6_RST CSI_RST = SparkFun-Switches:MOMENTARY-SWITCH-SPST: Momentary Switch (Pushbutton) - SPST Normally-open (NO) SPST momentary switches (buttons, pushbuttons). Variants PTH-12MM - 12mm square, through-hole Momentary Pushbutton Switch - 12mm Square <https://www.sparkfun.com/products/9190> (COM-09190) PTH-6.0MM, PTH-6.0MM-KIT - 6.0mm square, through-hole Mini Pushbutton Switch <https://www.sparkfun.com/products/97> (COM-00097) KIT package intended for soldering kit's - only one side of pads' copper is exposed. PTH-RIGHT-ANGLE-KIT - Right-angle, through-hole Right Angle Tactile Button <https://www.sparkfun.com/products/10791> - Used on SparkFun BigTime Watch Kit <https://www.sparkfun.com/products/11734> SMD-12MM - 12mm square, surface-mount Tactile Button - SMD (12mm) <https://www.sparkfun.com/products/12993> (COM-12993) Used on SparkFun PicoBoard <https://www.sparkfun.com/products/11888> SMD-4.5MM - 4.5mm Square Trackball Switch Used on SparkFun Blackberry Trackballer Breakout <https://www.sparkfun.com/products/13169> SMD-4.6MMX2.8MM - 4.60mm x 2.80mm, surface mount Used on SparkFun SAMD21 Mini Breakout <https://www.sparkfun.com/products/13664> SMD-5.2MM, SMD-5.2-REDUNDANT - 5.2mm square, surface-mount Mini Pushbutton Switch - SMD <https://www.sparkfun.com/products/8720> (COM-08720) Used on Arduino Pro Mini <https://www.sparkfun.com/products/11114> REDUNDANT package connects both switch circuits together SMD-6.0X3.5MM - 6.0 x 3.5mm, surface mount Momentary Reset Switch SMD <https://www.sparkfun.com/products/8229> (COM-08229) SMD-6.2MM-TALL - 6.2mm square, surface mount Tactile Button - SMD (6mm) <https://www.sparkfun.com/products/12992> Used on SparkFun Digital Sandbox <https://www.sparkfun.com/products/12651> SMD-RIGHT-ANGLE - Right-angle, surface mount Used on SparkFun Block for Intel® Edison - Arduino <https://www.sparkfun.com/products/13036>; PROD_ID: SWCH-13065
C6_EN C6_IO9 C6_U0RXD C6_U0TXD UN UP VPWR = Discrete:PAD-TEST-POINT-CIRCLE; PARTNO: DNP
C159-C164 = Discrete-new:CAP: Ceramic Capacitors
C195 C204 = SparkFun-Capacitors:68UF-POLAR: 68µF polarized capacitors A capacitor is a passive two-terminal electrical component used to store electrical energy temporarily in an electric field.; PROD_ID: CAP-10790; VALUE: 68uF
CHRG DONE PWR = microbuilder:LED: LED
D1 D6 = Discrete:D*
D2 D7 D13 = L:DISCRETE_D*
D3 D8 = SparkFun-DiscreteSemi:DIODE-ZENER: Zener Diode A Zener diode allows current to flow from its anode to its cathode like a normal semiconductor diode, but it also permits current to flow in the reverse direction when its "Zener voltage" is reached. - WIkipedia; PROD_ID: DIO-12442; VALUE: 5.6V
D4 D10 = microbuilder:TVSARRAY_5LANE: Voltage Transient Suppressor Array SOT363 SMF05C - 100W 5V: Digikey - SMF05CT1GOSCT-ND
D5 D12 = diode:DIODE-: DIODE
FB1-FB5 = SparkFun-Coils:INDUCTOR: Inductors Resist changes in electrical current. Basically a coil of wire. SparkFun Products: SparkFun Load Cell Amplifier - HX711 <https://www.sparkfun.com/products/13879> IOIO-OTG - V2.2 <https://www.sparkfun.com/products/13613>; PROD_ID: NDUC-07859
GPS LTE = Connector:ANTENNA-U-FL
J1 J2 = Connector-new:GROVE-CONNECTOR-SMD: 4P-SMD-2.0:320110030;4P-SMD-2.0-90D:320110032
J3 = Connector:XH2.54-2P
J4 = self:FPC-24P
J6 J10 = user:CON2X20-254P-A
J7 = user:HR961160C
J8 = user:CON31-30P-A
L1 L3 L4 = SparkFun-Coils:INDUCTOR: Inductors Resist changes in electrical current. Basically a coil of wire. SparkFun Products: SparkFun Load Cell Amplifier - HX711 <https://www.sparkfun.com/products/13879> IOIO-OTG - V2.2 <https://www.sparkfun.com/products/13613>; PROD_ID: NDUC-11157; VALUE: 3.3µH/±30%/3.4A
L2 = SparkFun-Coils:INDUCTOR: Inductors Resist changes in electrical current. Basically a coil of wire. SparkFun Products: SparkFun Load Cell Amplifier - HX711 <https://www.sparkfun.com/products/13879> IOIO-OTG - V2.2 <https://www.sparkfun.com/products/13613>; PROD_ID: NDUC-11627; VALUE: 33µH/±20%/1.4A
L5 = Discrete-new:INDUCTOR/FERRITE-BEAD
L6 = Discrete:L*
L7 = SparkFun-Coils:INDUCTOR: Inductors Resist changes in electrical current. Basically a coil of wire. SparkFun Products: SparkFun Load Cell Amplifier - HX711 <https://www.sparkfun.com/products/13879> IOIO-OTG - V2.2 <https://www.sparkfun.com/products/13613>; PROD_ID: NDUC-10789; VALUE: 47µH/±30%/750mA
M1-M9 = sale:M2.5
MIC = Connector-new:MIC-MSM421A3729H8-C
NET STA = adafruit2:LED: LED
P1 = Makerfabs-Peter:DEBUG*6
P2 P4 = self:AFC01-S06FCC-00
PWR1 = sale:JS102011JAQN
Q1 Q5 Q6 Q10 Q13 Q16 Q21 Q24 = User-Submitted:MOSFET-PCHANNEL: Generic PMOSFET IRLML2244 - TRANS-11153 (SOT-23 -20V -4.3A) (1.Gate 2.Source 3.Drain) FQP27P06 - COM-10349 <http://www.sparkfun.com/products/10349> (TO-220 -60V -27A) (1.Gate 2.Source 3.Drain); PROD_ID: TRANS-08285
Q2 = microbuilder:CRYSTAL: Crystals HC49UP - Surface Mount Crystal 4.0MHz 18pF +/-30ppm Surface Mount Crystal [Digikey: 535-9857-1-ND] 12.0 MHz Surface Mount Crystal [Digikey: 535-9869-6-ND] 25.0 MHz Surface Mount Crystal [Digikey: 535-9078-1-ND] 2.5 x 2.0mm - MEMs SMT Crystal 16.0 MHz 10pF 20ppm 2.5 x 2.0mm Crystal [Digikey -40-85°C: 535-10923-1-ND] 3.2 x 2.5mm - MEMs SMT Crystal 12.0 MHz 8pF 15ppm 3.2 x 2.5mm Crystal [Digikey: -10-70°C: 644-1047-1-ND -40-125°C: 644-1128-1-ND] 40~85°C cheaper: 644-1173-6-ND 16.0 MHz 8pF 15ppm 3.2 x 2.5mm Crystal [Digikey: -10-70°C: 644-1049-1-ND -40-125°C: 644-1129-2-ND]-40~85°C cheaper: 644-1175-6-ND 16.0 MHz 10pF 10ppm 3.2 x 2.5mm Crystal [Digikey: 644-1100-1-ND] 27.12 MHz 18pF 30ppm 3.2 x 2.5mm Crystal [Digikey: 887-1424-1-ND] 27.12MHz 10pF 10ppm 3.2 x 2.5mm Crystal [Digikey: 887-1329-1-ND] 4.9 x 1.8mm - MEMs SMT Crystal 32.768 KHz 12.5pF 20ppm 4.9 x 1.8mm Crystal [Digikey: SE2415CT-ND] 8.0 x 3.8mm - Surface Mount Crystal 32.768kHz 12.5pF 20ppm -40°C-85°C [Digikey: 535-9166-2-ND] Cylinder 32.768KHz Cylinder Crystal (2x6mm body) [Ex. Digikey: 300-8341-2-ND]
Q3 Q4 Q7 = Discrete:TRANSISTOR-NPN*: NPN audion
Q8 Q9 Q11 Q12 Q14 Q15 Q17 Q18 Q22 Q23 Q25-Q28 = SparkFun-DiscreteSemi:TRANS_PNP: PNP transistor Current controlled devices typically used to amplify current or used as a switch. SparkFun Products: SparkFun Serial Enabled 16x2 LCD - Red on Black <https://www.sparkfun.com/products/9068> SparkFun Logomatic <https://www.sparkfun.com/products/12772>; PROD_ID: TRANS-09245
Q19 Q20 Q29-Q36 = Discrete:MOSFET-N: IRLL014: http://www.vishay.com/docs/91319/sihll014.pdf
R1 R4-R9 R12-R15 R19 R23 R27 R31-R33 R36-R39 R42 R44 R47 R51 R53 R55 R57-R60 R69 R70 R72 R73 R108 R149 R156-R161 R172-R177 R180 R181 R186-R195 R241 R242 = A9G:DISCRETE_R*
R2 R3 R10 R11 R16-R18 R20-R22 R24-R26 R29 R30 R34 R35 R40 R41 R43 R45 R46 R48-R50 R52 R54 R56 R63-R68 R71 R74-R107 R109-R148 R150-R155 R162-R171 R178 R179 R182-R185 R196-R200 R207-R228 R230-R232 R235 R238-R240 R243 R244 = Discrete:R*
R236 R237 = borkedlabs-passives:RESISTOR: Resistor Basic schematic elements and footprints for 0603, 1206, and PTH resistors.; PACKAGE: 1206
SD = Connector:HOLDER-MICROSD-9P
SIM = Connector:MICROSIM
SPK = sale:1X2P
U1 = ESP32-C6-MINI-1:ESP32-C6-MINI-1; PROD_ID: IC-19033
U2 = sale:RY3730
U3 = sale:CH340K
U4 = sale:MP2143DJ-LF-Z
U5 U10 U14-U16 = IC:SPX3819
U7 = IC:LD1117: Low Drop Fixed And Adjustable Positive Voltage Regulators http://www.datasheetcatalog.org/datasheet/SGSThomsonMicroelectronics/mXuqtqv.pdf
U8 = user:ESP32-P4
U9 = self:W25Q128JV
U11 U17 = user:TLV62569DBVR
U12 = user:ES8311
U13 = user:IP101GRI
U18 = sale:A7670G
U19 = user:TP5100
U20 = user:NS4150B
USB-CDC/JTAG USB-DEVICE USB-LTE USB-NATIVE USB-OTG USB-TTL = USBC:USB_C: USB Type C 16Pin Connector Super Speed pins not available on the 16-pin purely SMD connector so this part is best for USB 2.0 implementations. D1 and D2 are tied together enabling D+/- no matter which way the cable is plugged into the connector. The two channel configuration pins (CC1/2) are exposed. These are normally connected to ground via 5.1k resistors but can be reconfigured for high current/high power applications.
X1 X2 = adafruit:XTAL-4: Classic 4-pin 3.2 x 2.5mm crystal
X3 = Discrete-new:CRYSTAL-OSCILLATOR

## Net classes
0 default: width 0.152 mm, drill 0.305 mm, clearance 0.152 mm
1 vbat: drill 0.305 mm